# EAGLE board tc083-18 (EAGLE 6.6.0), part 1 of 6
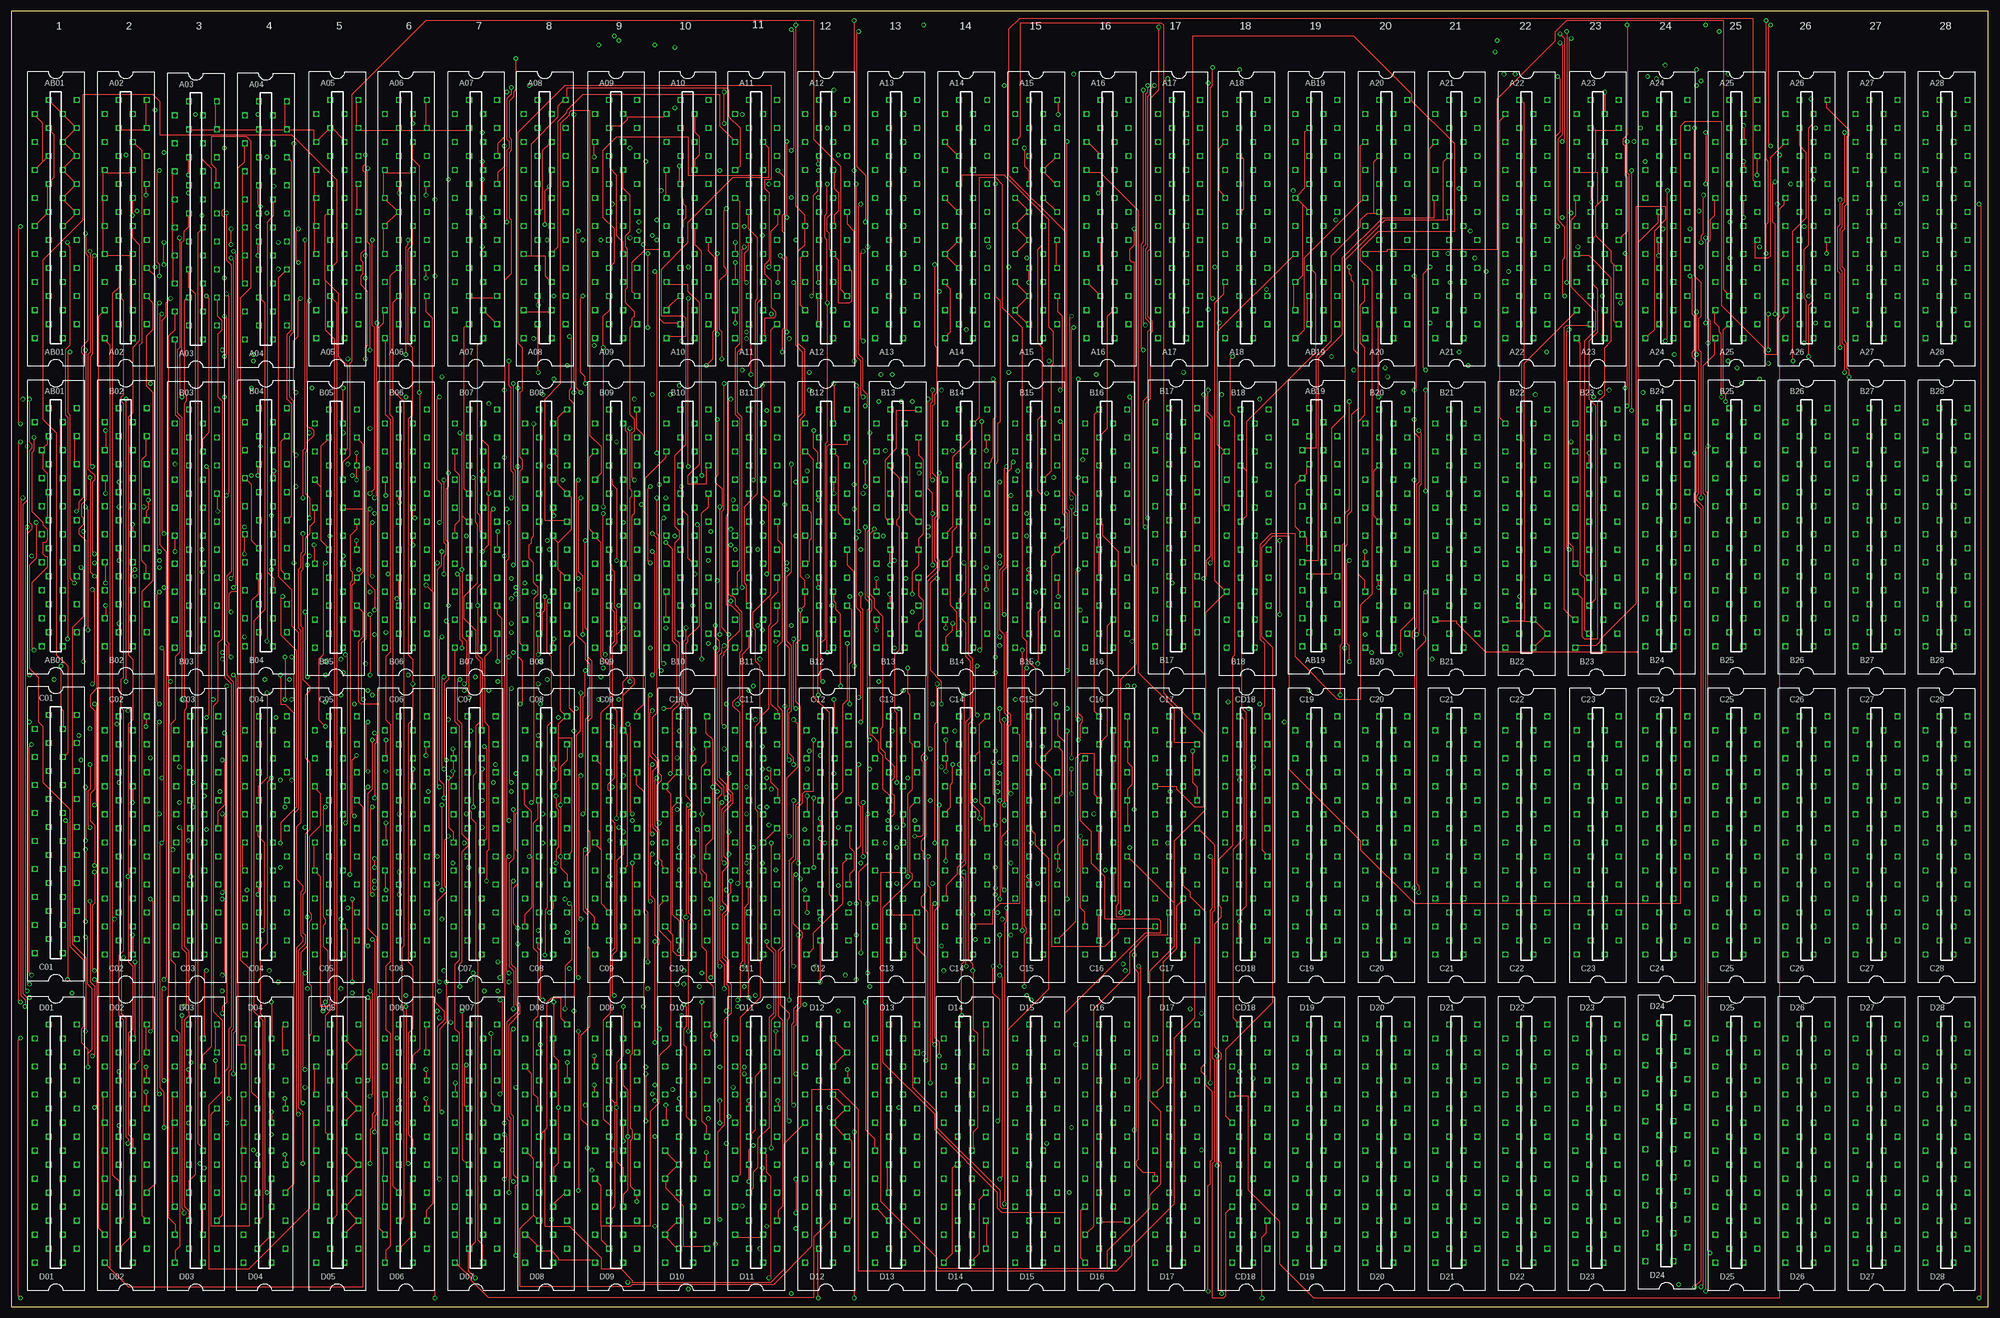
[diagram p12: board, top side]
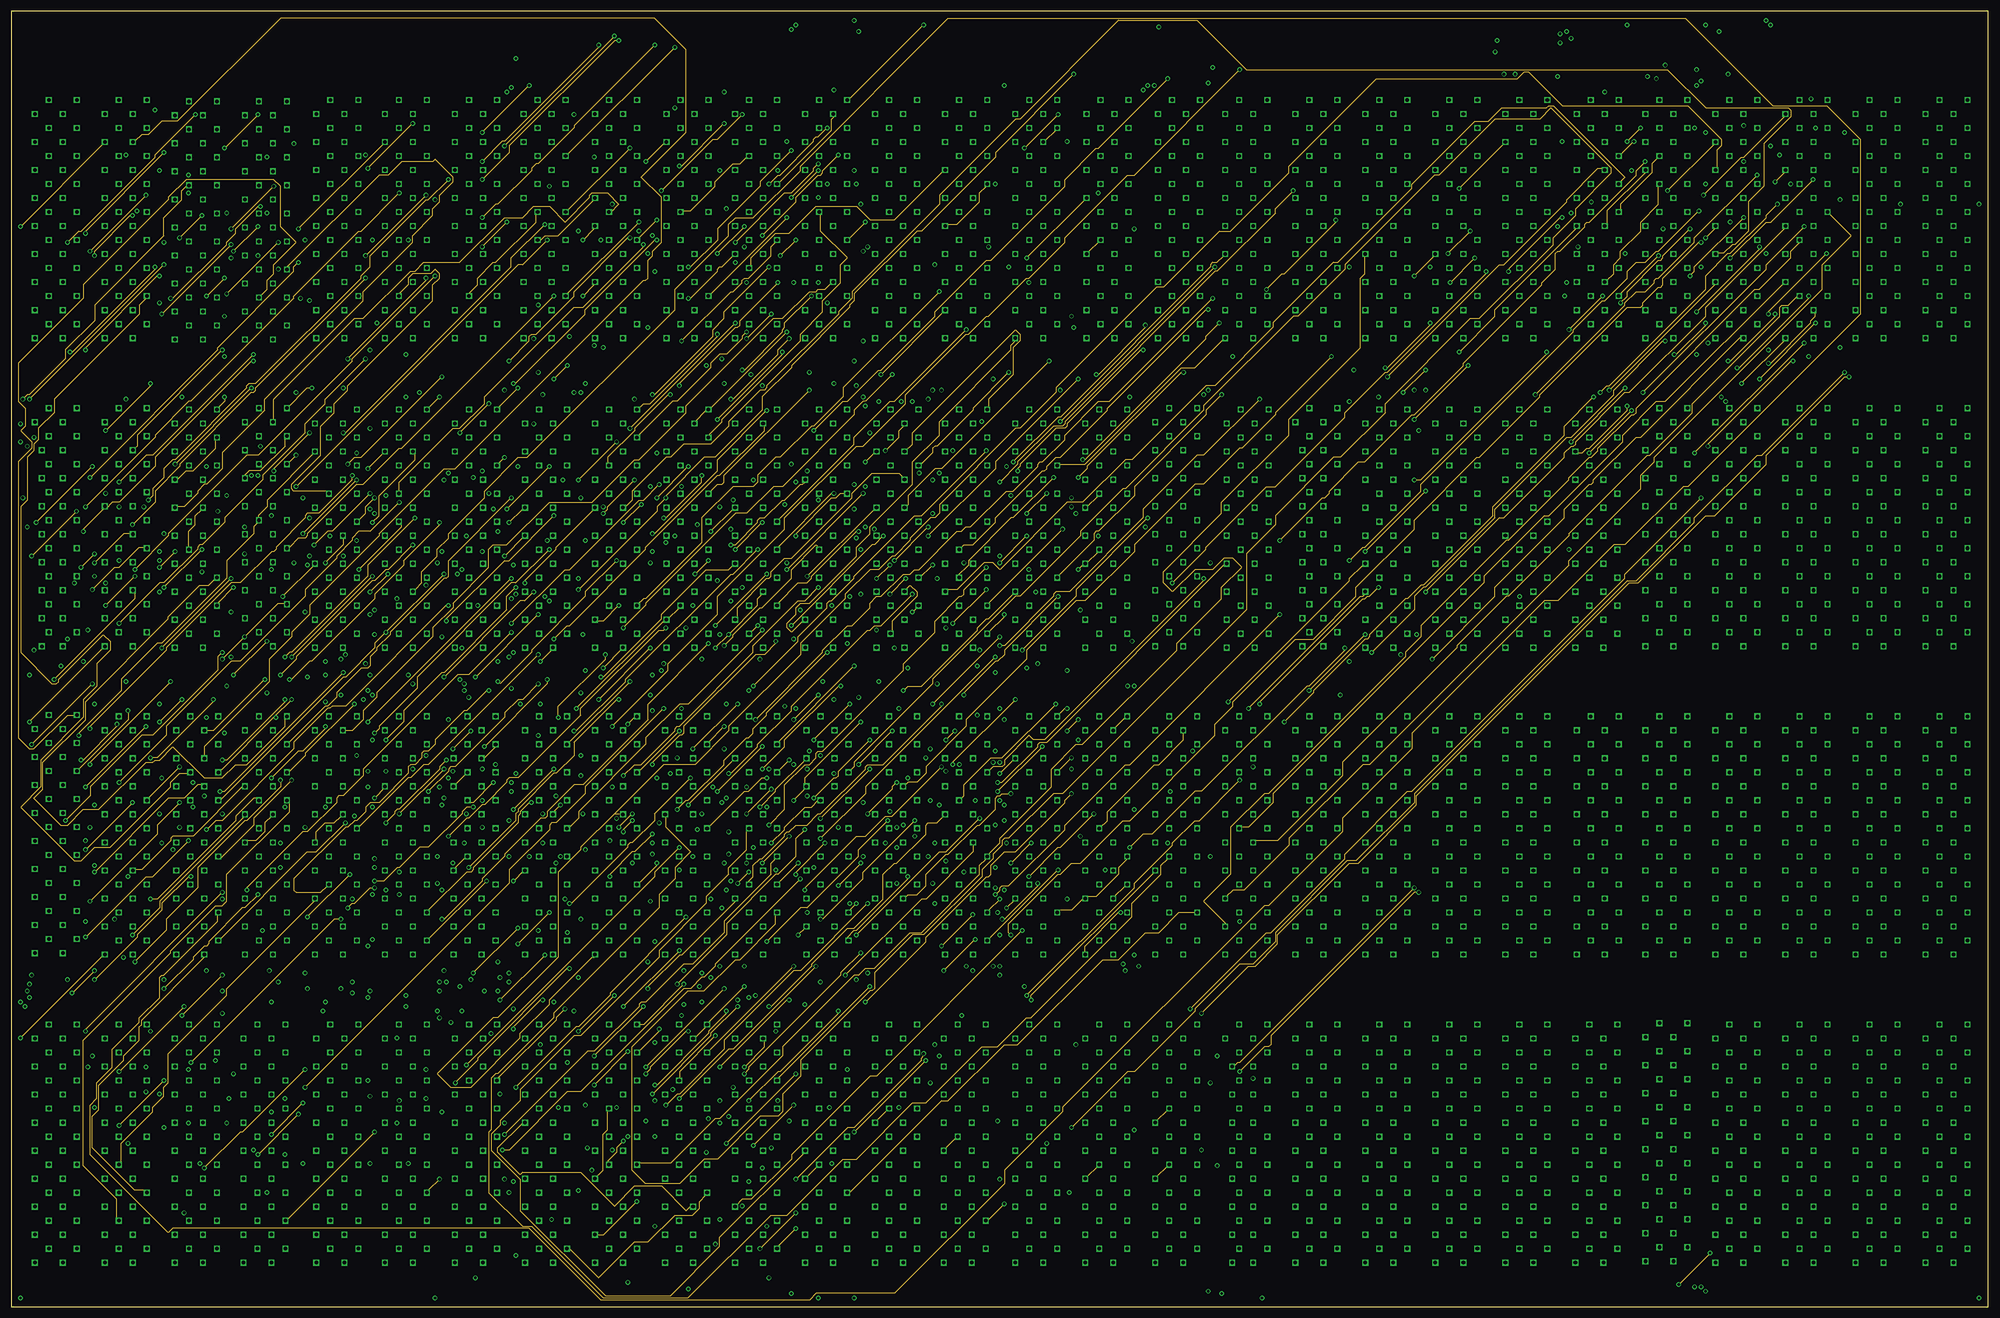
[diagram p13: board, inner layer Route2]
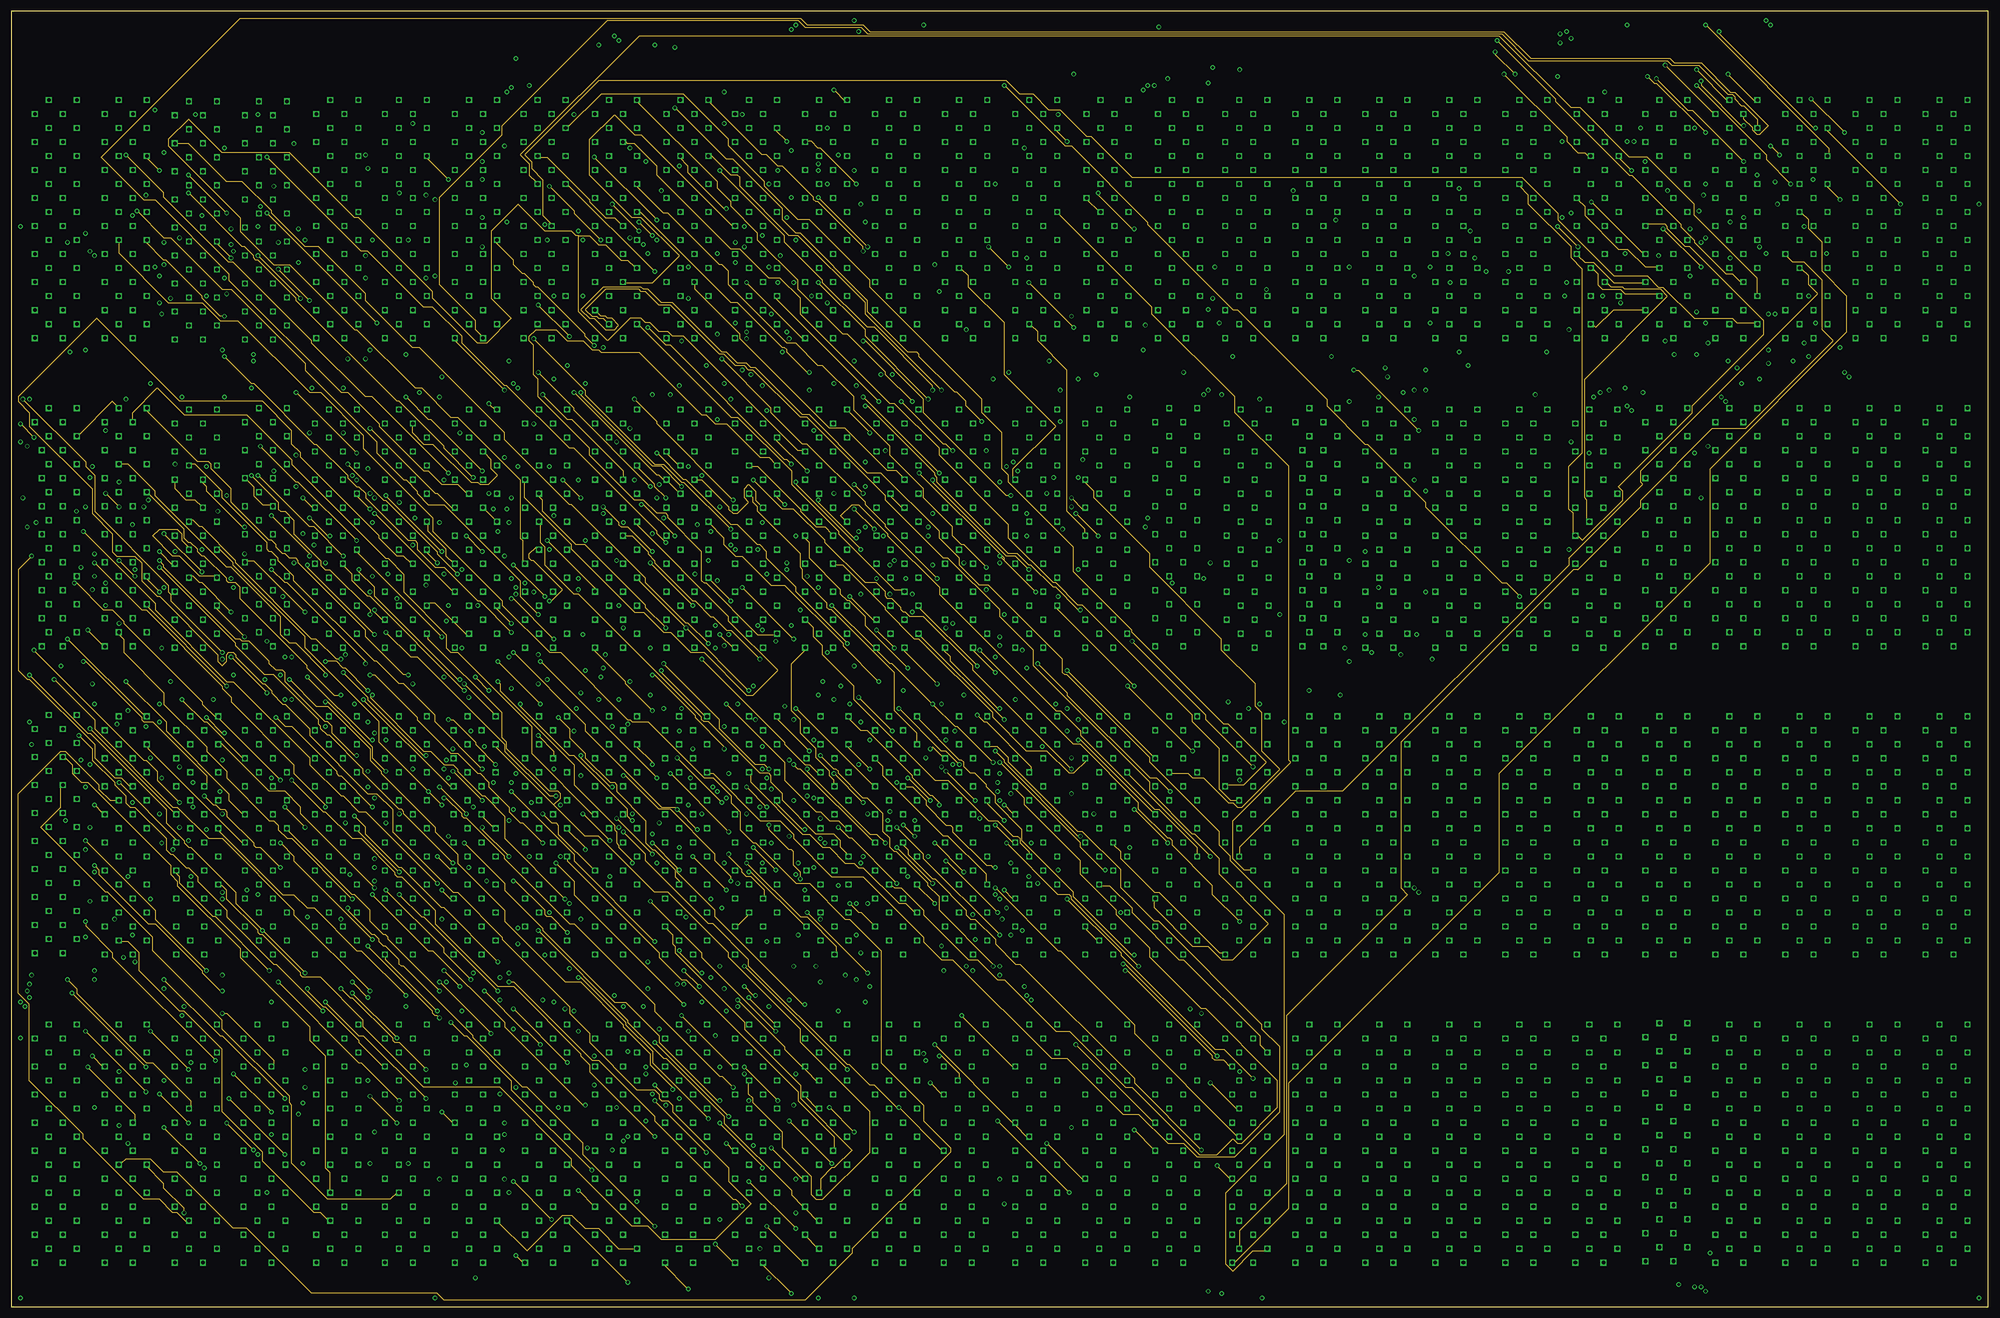
[diagram p14: board, inner layer Route15]
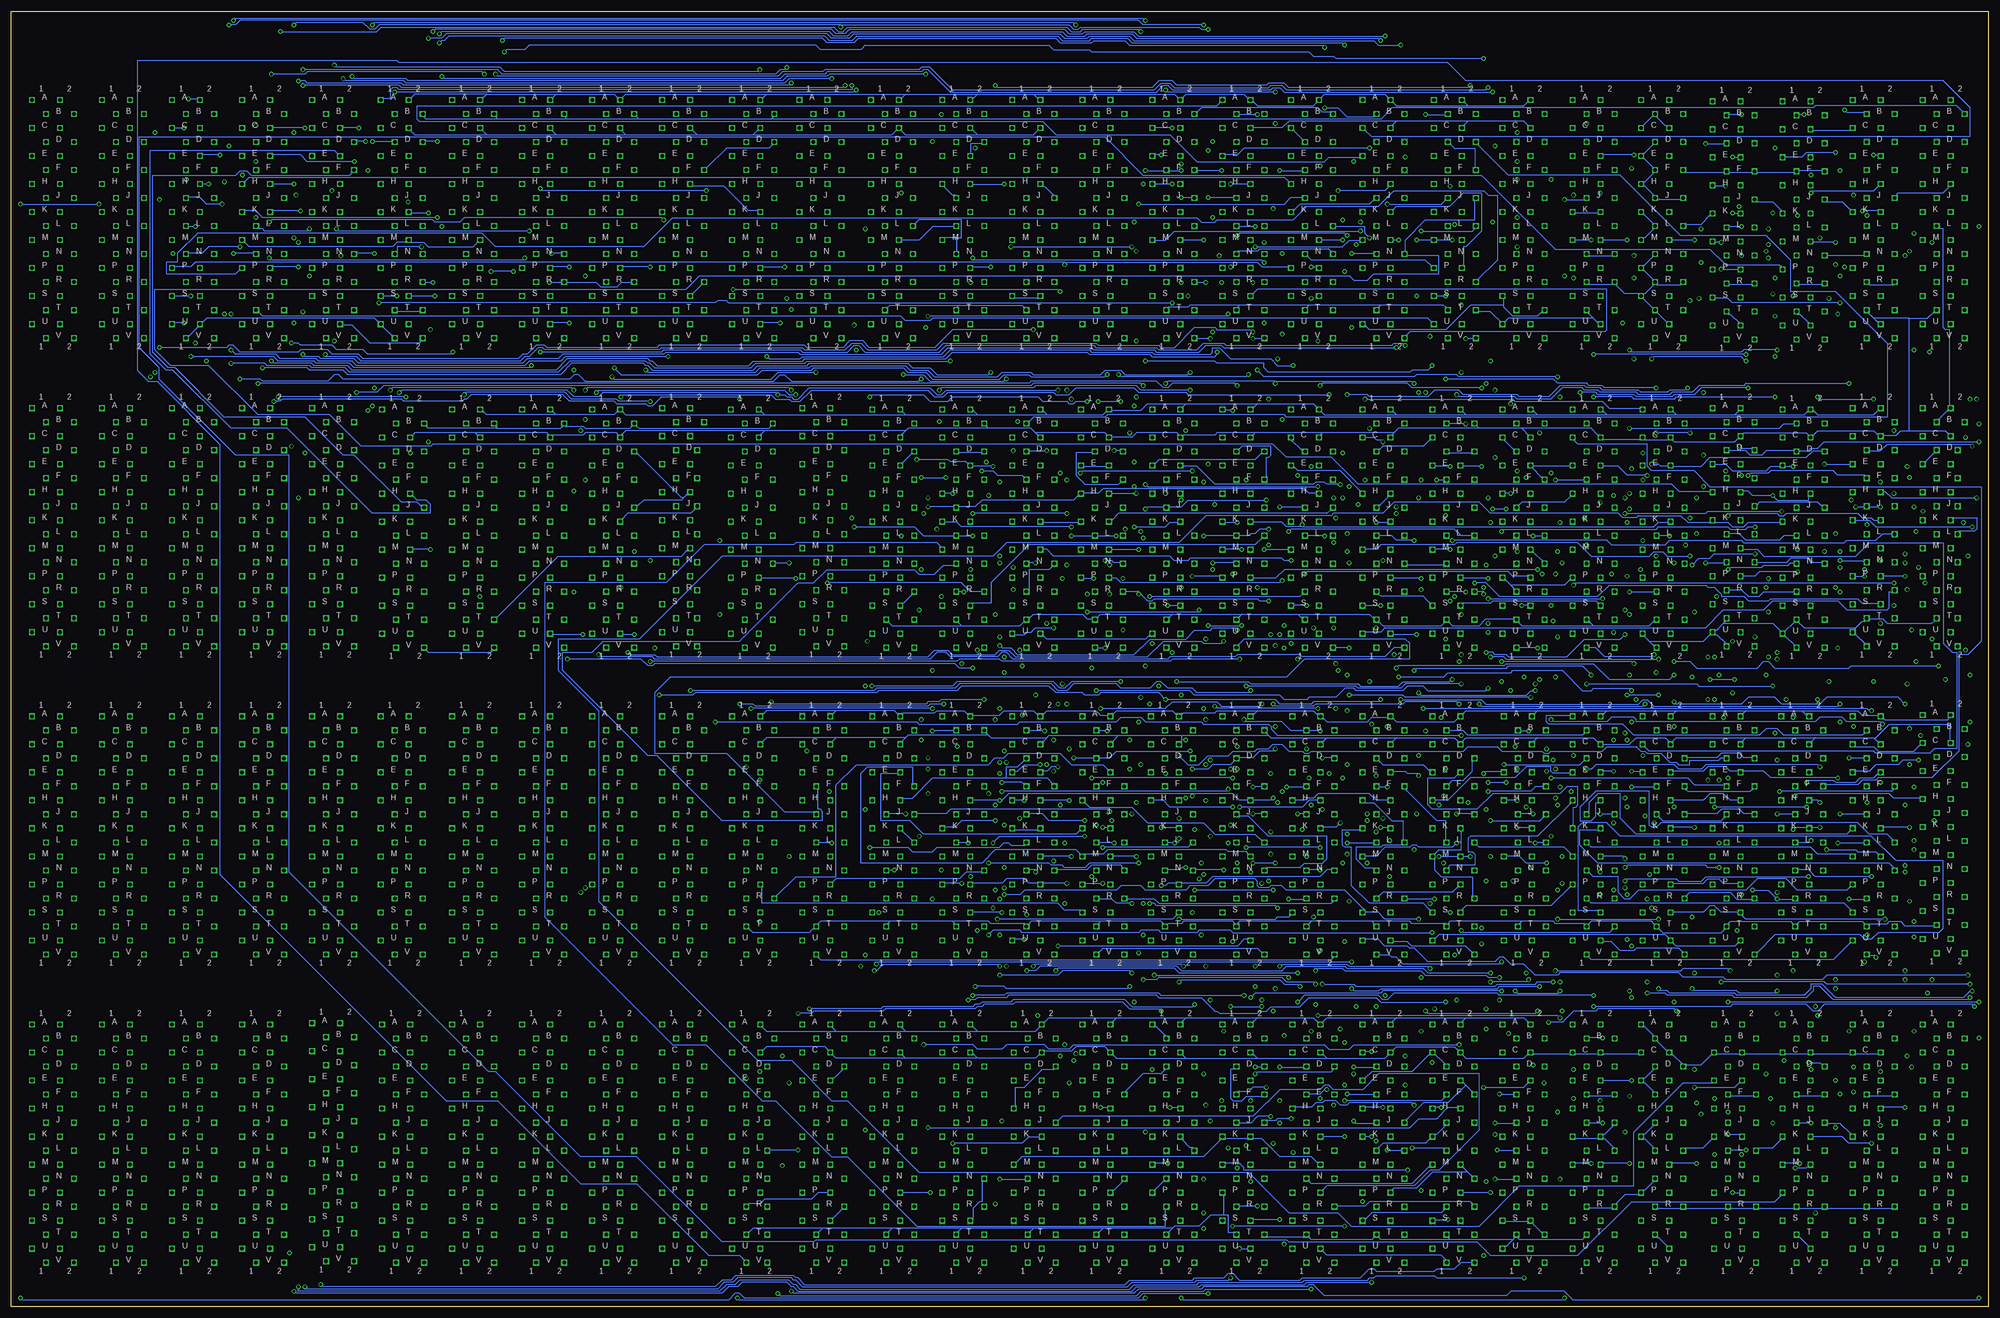
[diagram p15: board, bottom side, seen from below]

Size 448.29 x 293.68 mm. Coordinates in mm from the lower left corner, seen from the top.
Outline: 0,0 448.29,0 448.29,293.68 0,293.68 0,0
Copper layers (1*16): Top 0.035mm / dielectric 1.5mm / Bottom 0.035mm
Design rules "10mils": minimum track width 10mil, minimum drill 24mil, track to track 10mil, track to pad 10mil, pad to pad 10mil, via to via 10mil, smd to smd 10mil, copper to edge 40mil, drill to drill 10mil, minimum pad ring 10mil, minimum via ring 8mil, stop-mask expansion 0mil, vias tented up to drill 0mil, thermal gap 10mil

## Footprints (pad centres in the part's own frame; a part is rotated, then mirrored left to right if it is on the bottom)
H807 = drill 0.813 square: A1 4.763,28.575; A2 -1.587,28.575; B1 1.587,25.4; B2 -4.763,25.4; C1 4.763,22.225; C2 -1.587,22.225; D1 1.587,19.05; D2 -4.763,19.05; E1 4.763,15.875; E2 -1.587,15.875; F1 1.587,12.7; F2 -4.763,12.7; H1 4.763,9.525; H2 -1.587,9.525; J1 1.587,6.35; J2 -4.763,6.35; K1 4.763,3.175; K2 -1.587,3.175; L1 1.587,0; L2 -4.763,0; M1 4.763,-3.175; M2 -1.587,-3.175; N1 1.587,-6.35; N2 -4.763,-6.35; P1 4.763,-9.525; P2 -1.587,-9.525; R1 1.587,-12.7; R2 -4.763,-12.7; S1 4.763,-15.875; S2 -1.587,-15.875; T1 1.587,-19.05; T2 -4.763,-19.05; U1 4.763,-22.225; U2 -1.587,-22.225; V1 1.587,-25.4; V2 -4.763,-25.4
H807-2 = drill 0.813 square: AA1 4.763,60.325; AA2 -1.587,60.325; AB1 1.587,57.15; AB2 -4.763,57.15; AC1 4.763,53.975; AC2 -1.587,53.975; AD1 1.587,50.8; AD2 -4.763,50.8; AE1 4.763,47.625; AE2 -1.587,47.625; AF1 1.587,44.45; AF2 -4.763,44.45; AH1 4.763,41.275; AH2 -1.587,41.275; AJ1 1.587,38.1; AJ2 -4.763,38.1; AK1 4.763,34.925; AK2 -1.587,34.925; AL1 1.587,31.75; AL2 -4.763,31.75; AM1 4.763,28.575; AM2 -1.587,28.575; AN1 1.587,25.4; AN2 -4.763,25.4; AP1 4.763,22.225; AP2 -1.587,22.225; AR1 1.587,19.05; AR2 -4.763,19.05; AS1 4.763,15.875; AS2 -1.587,15.875; AT1 1.587,12.7; AT2 -4.763,12.7; AU1 4.763,9.525; AU2 -1.587,9.525; AV1 1.587,6.35; AV2 -4.763,6.35; BA1 4.763,-9.525; BA2 -1.587,-9.525; BB1 1.587,-12.7; BB2 -4.763,-12.7; BC1 4.763,-15.875; BC2 -1.587,-15.875; BD1 1.587,-19.05; BD2 -3.175,-19.05; BE1 4.763,-22.225; BE2 -1.587,-22.225; BF1 1.587,-25.4; BF2 -3.175,-25.4; BH1 4.763,-28.575; BH2 -1.587,-28.575; BJ1 1.587,-31.75; BJ2 -3.175,-31.75; BK1 4.763,-34.925; BK2 -1.587,-34.925; BL1 1.587,-38.1; BL2 -3.175,-38.1; BM1 4.763,-41.275; BM2 -1.587,-41.275; BN1 1.587,-44.45; BN2 -3.175,-44.45; BP1 4.763,-47.625; BP2 -1.587,-47.625; BR1 1.587,-50.8; BR2 -3.175,-50.8; BS1 4.763,-53.975; BS2 -1.587,-53.975; BT1 1.587,-57.15; BT2 -3.175,-57.15; BU1 4.763,-60.325; BU2 -1.587,-60.325; BV1 1.587,-63.5; BV2 -3.175,-63.5

## Placement (x,y rotation side)
A02  M903  [H807]  26.03,244.94 0 top
A03  M903  [H807]  41.91,244.63 0 top
A04  M903  [H807]  57.78,244.63 0 top
A05  M903  [H807]  73.97,244.94 0 top
A06  M903  [H807]  89.53,244.94 0 top
A07  A07  [H807]  105.41,244.94 0 top
A08  M206X  [H807]  120.96,244.94 0 top
A09  [H807]  137.16,244.94 0 top
A10  [H807]  153.35,244.94 0 top
A11  A11  [H807]  168.91,244.94 0 top
A12  A12  [H807]  184.78,244.94 0 top
A13  H807  [H807]  200.66,244.94 0 top
A14  [H807]  216.53,244.94 0 top
A15  [H807]  232.41,244.94 0 top
A16  [H807]  248.6,244.94 0 top
A17  H807  [H807]  264.79,244.94 0 top
A18  [H807]  280.03,244.94 0 top
A20  [H807]  311.78,244.94 0 top
A21  [H807]  327.65,244.94 0 top
A22  [H807]  343.53,244.94 0 top
A23  [H807]  359.72,244.94 0 top
A24  W023  [H807]  375.28,244.94 0 top
A25  M916  [H807]  391.15,244.94 0 top
A26  M916  [H807]  407.03,244.94 0 top
A27  H807  [H807]  422.9,244.94 0 top
A28  H807  [H807]  438.78,244.94 0 top
AB01  [H807-2]  10.16,213.19 0 top
AB19  [H807-2]  295.9,213.19 0 top
B02  [H807]  26.03,175.09 0 top
B03  [H807]  41.91,174.78 0 top
B04  [H807]  57.78,175.09 0 top
B05  [H807]  73.66,174.78 0 top
B06  B06  [H807]  89.53,174.78 0 top
B07  B07  [H807]  105.41,174.78 0 top
B08  B08  [H807]  121.28,174.78 0 top
B09  M206X  [H807]  137.16,174.78 0 top
B10  B10  [H807]  153.35,174.78 0 top
B11  [H807]  168.91,174.78 0 top
B12  [H807]  184.78,174.78 0 top
B13  M206X  [H807]  200.97,174.78 0 top
B14  M206X  [H807]  216.53,174.78 0 top
B15  [H807]  232.41,174.78 0 top
B16  [H807]  248.28,174.78 0 top
B17  H807  [H807]  264.15,175.09 0 top
B18  [H807]  280.35,174.78 0 top
B20  [H807]  311.78,174.78 0 top
B21  [H807]  327.65,174.78 0 top
B22  [H807]  343.53,174.78 0 top
B23  [H807]  359.4,174.78 0 top
B24  H807  [H807]  375.28,175.09 0 top
B25  H807  [H807]  391.15,175.09 0 top
B26  H807  [H807]  407.03,175.09 0 top
B27  H807  [H807]  422.9,175.09 0 top
B28  H807  [H807]  438.78,175.09 0 top
C01  C01  [H807]  10.16,105.56 0 top
C02  [H807]  26.03,105.25 0 top
C03  [H807]  42.22,105.25 0 top
C04  C04  [H807]  57.78,105.25 0 top
C05  C05  [H807]  73.66,105.25 0 top
C06  C06  [H807]  89.53,105.25 0 top
C07  B07  [H807]  105.09,105.25 0 top
C08  C08  [H807]  121.28,105.25 0 top
C09  M206X  [H807]  137.16,105.25 0 top
C10  [H807]  153.03,105.25 0 top
C11  [H807]  168.91,105.25 0 top
C12  [H807]  185.1,105.25 0 top
C13  [H807]  200.66,105.25 0 top
C14  M206X  [H807]  216.53,105.25 0 top
C15  [H807]  232.41,105.25 0 top
C16  C16  [H807]  248.28,105.25 0 top
C17  C17  [H807]  264.15,105.25 0 top
C19  H807  [H807]  295.9,105.25 0 top
C20  H807  [H807]  311.78,105.25 0 top
C21  H807  [H807]  327.65,105.25 0 top
C22  H807  [H807]  343.53,105.25 0 top
C23  H807  [H807]  359.72,105.25 0 top
C24  H807  [H807]  375.28,105.25 0 top
C25  H807  [H807]  391.15,105.25 0 top
C26  H807  [H807]  407.03,105.25 0 top
C27  H807  [H807]  422.9,105.25 0 top
C28  H807  [H807]  438.78,105.25 0 top
CD18  [H807-2]  280.03,73.5 0 top
D01  H807  [H807]  10.16,35.39 0 top
D02  M903  [H807]  26.03,35.39 0 top
D03  M903  [H807]  41.91,35.39 0 top
D04  M903  [H807]  57.46,35.39 0 top
D05  M903  [H807]  73.97,35.39 0 top
D06  M903  [H807]  89.53,35.39 0 top
D07  D07  [H807]  105.41,35.39 0 top
D08  [H807]  121.28,35.39 0 top
D09  [H807]  137.16,35.39 0 top
D10  [H807]  153.03,35.39 0 top
D11  M206X  [H807]  168.91,35.39 0 top
D12  D12  [H807]  184.78,35.39 0 top
D13  D13  [H807]  200.66,35.39 0 top
D14  [H807]  216.21,35.39 0 top
D15  [H807]  232.41,35.39 0 top
D16  [H807]  248.28,35.39 0 top
D17  D17  [H807]  264.15,35.39 0 top
D19  H807  [H807]  295.9,35.39 0 top
D20  H807  [H807]  311.78,35.39 0 top
D21  H807  [H807]  327.65,35.39 0 top
D22  H807  [H807]  343.53,35.39 0 top
D23  H807  [H807]  359.4,35.39 0 top
D24  H807  [H807]  375.28,35.71 0 top
D25  H807  [H807]  391.15,35.39 0 top
D26  H807  [H807]  407.03,35.39 0 top
D27  H807  [H807]  422.9,35.39 0 top
D28  H807  [H807]  438.78,35.39 0 top

## Tracks (layer width: path | path; a pad name or v marks a point on that pad's centre or on a via)
0_TO_DTB  (via drill 0.61)
  Top 0.254: v162.68,102.58 v162.68,107.66 | v149.47,120.87 149.98,121.37 149.98,135.09 151.51,136.61 151.51,150.33 150.49,151.35 150.49,173.19 151.51,174.21 151.51,175.73 150.49,176.75 150.49,193 153.03,195.54 153.03,217.89 v152.01,218.91
  Route2 0.254: v152.01,218.91 163.19,230.09 163.7,230.09 165.73,232.12 165.73,232.63 166.24,233.13 167.25,233.13 172.33,238.21 172.33,240.25 173.35,241.26 A11.M1
  Route15 0.254: v162.68,102.58 162.68,102.07 165.73,99.02 165.73,98.51 166.75,97.5 167.76,97.5 170.81,94.45 170.81,92.93 C11.R1 | v162.68,107.66 v149.47,120.87
0_TO_EF
  Route2 0.254: A10.K2 152.01,248.37 154.05,248.37 159.63,253.96 159.63,254.98 163.7,259.04 165.22,259.04 166.75,260.57 A11.E2
0_TO_STA
  Bottom 0.254: A10.N2 148.97,239.23 149.47,239.74 165.22,239.74 165.73,239.23 170.3,239.23 A11.N1
1_TO_DF  (via drill 0.61)
  Top 0.254: C12.L1 186.56,105.63 186.56,111.21 C12.J1 186.56,112.23 186.56,114.77 188.59,116.8 188.59,136.61 189.61,137.63 v189.61,150.33 | v145.92,234.66 146.43,234.15 v146.43,193.51 | v177.92,52.79 177.41,53.3 177.41,63.46 177.92,63.97 177.92,67.02 178.94,68.03 178.94,83.27 179.45,83.78 179.45,84.8 177.41,86.83 177.41,97.5 v177.92,98.01
  Route2 0.254: v177.92,52.79 v162.17,37.05 | v177.92,98.01 177.92,98.51 v184.53,105.12
  Route15 0.254: v145.92,234.66 126.11,254.47 A08.H1 | v146.43,193.51 152.52,187.41 153.03,187.41 163.19,177.25 164.71,177.25 169.29,172.68 169.79,172.68 171.32,171.16 171.32,169.63 177.92,163.03 177.92,162.01 v189.61,150.33 | v162.17,37.05 163.7,35.52 D11.L2
  Bottom 0.254: v184.53,105.12 186.05,105.12 C12.L1
1_TO_DTF  (via drill 0.61)
  Top 0.254: v160.65,19.77 160.14,20.28 160.14,39.59 161.67,41.11 161.67,64.99 163.19,66.51 163.19,73.11 162.68,73.62 162.68,78.7 161.67,79.72 161.67,88.35 162.68,89.37 162.68,93.43 163.19,93.94 v163.19,96.48 | v183,163.03 183,165.06 B12.P2
  Route2 0.254: v138.81,120.36 141.35,122.9 142.87,122.9 150.49,130.52 150.49,131.03 151,131.53 151.51,131.53 168.27,148.3 168.27,149.82 178.43,159.98 179.95,159.98 v183,163.03
  Route15 0.254: v163.19,96.48 163.19,97.5 159.63,101.05 159.63,102.58 149.47,112.74 146.93,112.74 139.31,120.36 v138.81,120.36
  Bottom 0.254: v160.65,19.77 166.75,19.77 D11.S2
76
  Bottom 0.254: C04.V2 52.45,80.23 48.38,84.29 29.08,84.29 28.06,83.27 26.54,83.27 25.01,84.8 11.3,84.8 10.28,85.81 10.28,101.05 20.95,101.05 26.54,106.64 83.43,106.64 86.48,109.69 92.07,109.69 93.09,108.67 93.09,89.88 88.51,89.88 C06.S2
76+77  (via drill 0.61)
  Route2 0.254: v82.42,94.96 81.4,94.96 77.85,91.4 77.34,91.4 v76.32,90.39
  Route15 0.254: v82.42,94.96 65.65,111.72 65.65,113.25 62.1,116.8 58.54,116.8 47.37,127.98 C03.C1 | v76.32,90.39 76.32,89.88 81.91,84.29 82.42,84.29 83.43,83.27 83.43,82.77 84.45,81.75 84.96,81.75 88.01,78.7 88.01,77.69 88.51,77.18 89.02,77.18 104.77,61.43 104.77,60.92 115.95,49.75 116.96,49.75 129.66,37.05 129.66,34.51 v145.92,18.25 | v171.32,18.25 179.45,10.12 D12.V2
  Bottom 0.254: v145.92,18.25 v171.32,18.25
77
  Bottom 0.254: C05.V2 69.21,80.23 70.23,81.24 79.88,81.24 80.39,80.73 83.43,80.73 85.47,82.77 87.5,82.77 C06.U2
!00  (via drill 0.61)
  Top 0.254: v106.8,266.15 106.8,264.63 A07.D1 | v342.01,161 342.01,159.47 B22.S2
  Route2 0.254: v106.8,266.15 v117.47,276.82
  Route15 0.254: v225.17,276.82 238.88,263.11 240.41,263.11 257.68,245.83 257.68,245.33 276.98,226.02 278,226.02 298.32,205.7 298.32,204.18 306.95,195.54 307.46,195.54 320.67,182.33 320.67,181.32 337.94,164.05 338.96,164.05 v342.01,161
  Bottom 0.254: v117.47,276.82 117.98,276.31 158.62,276.31 159.63,277.33 163.19,277.33 163.7,276.82 184.02,276.82 185.03,277.84 188.08,277.84 189.61,276.31 224.66,276.31 v225.17,276.82
!0_TO_AC  (via drill 0.61)
  Top 0.254: v81.4,180.81 80.89,180.3 80.89,164.05 82.42,162.52 v82.42,157.95
  Route15 0.254: v81.4,180.81 78.35,183.86 B05.H1 | v82.42,157.95 82.42,157.44 84.45,155.41 B06.T2
!0_TO_DTB  (via drill 0.61)
  Top 0.254: 143.38,181.83 143.38,136.61 141.85,135.09 141.85,134.07 C09.A1 | 143.38,181.83 143.38,197.57 141.85,199.1 141.85,203.16 B09.A1 | v140.84,111.72 140.33,112.23 140.33,131.53 v139.82,132.04 | 143.38,181.83 v142.87,181.83 | v160.14,220.43 v160.14,238.72
  Route2 0.254: v140.84,111.72 v137.79,108.67 | v139.82,132.04 141.35,133.57 C09.A1 | v142.87,181.83 v138.81,177.76 | v160.14,238.72 v166.24,244.82 | v160.14,220.43 160.14,219.93 144.9,204.69 143.38,204.69 142.36,203.67 B09.A1
  Route15 0.254: v150.49,174.71 143.38,181.83 v142.87,181.83
  Bottom 0.254: v137.79,108.67 135.76,108.67 C09.K2 | v138.81,177.76 135.76,177.76 B09.K2 | v150.49,174.71 154.55,174.71 B10.L1 | v166.24,244.82 170.3,244.82 A11.L1
!0_TO_EF
  Top 0.254: 117.98,238.21 121.03,238.21 121.03,233.64 122.04,232.63 A08.R1 | 117.98,238.21 116.45,238.21 A08.N2 | 117.98,238.21 117.98,263.61 124.07,269.71 124.07,272.25 125.09,273.27 A08.A1 126.11,273.77 126.11,276.31 162.17,276.31 162.68,275.81 162.68,269.71 165.22,267.17 165.22,258.53 164.71,258.03 A11.F2
!0_TO_LPB
  Top 0.254: 121.03,40.09 121.53,40.6 121.53,69.05 122.55,70.07 124.58,70.07 124.58,65.49 125.6,64.48 D08.A1 | 121.03,40.09 120.01,39.08 D08.K2 | 121.03,40.09 121.03,18.25 126.61,18.25 133.73,11.14 133.73,8.6 138.3,8.6 140.84,6.06 140.84,5.55 172.33,5.55 175.38,8.6 175.38,37.05 179.45,41.11 D12.J2
!0_TO_STA  (via drill 0.61)
  Top 0.254: 102.23,179.29 103.25,178.27 B07.K2 | 102.23,179.29 102.23,197.57 v101.72,198.08 | v102.74,141.19 103.25,141.69 103.25,150.84 102.23,151.85 v102.23,167.09 102.23,179.29 | v173.86,232.12 173.86,235.17 A11.P1
  Route2 0.254: v101.72,198.08 v108.33,204.69 | v173.86,232.12 165.22,223.48 165.22,222.47 164.71,221.96 164.21,221.96 151.51,209.26 v151.51,208.75 | v114.93,208.24 110.36,203.67 B07.A1
  Route15 0.254: v108.33,204.69 109.85,203.16 B07.A1 | v102.74,141.19 109.85,134.07 C07.A1
  Bottom 0.254: v102.23,167.09 159.63,167.09 161.67,165.06 166.75,165.06 B11.P2 | v151.51,208.75 151,209.26 131.69,209.26 130.68,208.24 v114.93,208.24
!0_TO_STATE
  Route15 0.254: CD18.AV2 274.95,80.23 273.93,80.23 260.22,93.94 259.2,93.94 251.58,101.56 251.58,103.09 250.06,104.61 C16.L1
!0_TO_W  (via drill 0.61)
  Top 0.254: v271.9,50.76 271.9,89.88 272.41,90.39 272.41,101.56 v271.9,102.07
  Route15 0.254: v271.9,50.76 278,44.67 CD18.BH2 | v271.9,102.07 253.11,120.87 C16.E1
!01  (via drill 0.61)
  Top 0.254: v350.64,244.82 350.64,245.33 350.13,245.83 350.13,265.14 351.15,266.15 351.15,278.35 v350.64,278.85 | v112.39,275.3 111.88,274.79 111.88,265.14 110.36,263.61 110.36,261.07 A07.E1
  Route15 0.254: v350.64,244.82 v355.21,240.25
  Bottom 0.254: v355.21,240.25 360.8,240.25 360.8,239.23 A23.N1 | v350.64,278.85 350.13,278.35 273.93,278.35 272.92,279.36 263.77,279.36 263.27,279.87 241.93,279.87 241.42,280.38 240.41,280.38 235.33,275.3 188.59,275.3 187.07,276.82 186.05,276.82 185.03,275.81 162.68,275.81 162.17,276.31 160.65,276.31 159.63,275.3 v112.39,275.3
!02  (via drill 0.61)
  Top 0.254: v106.8,255.49 106.8,251.93 A07.J1 | v351.15,288.51 352.17,287.49 352.17,264.63 v351.66,264.12
  Route2 0.254: v106.8,255.49 112.9,261.58 112.9,263.11 136.77,286.98 v137.79,286.98
  Bottom 0.254: v137.79,286.98 138.3,287.49 193.16,287.49 194.18,288.51 204.34,288.51 204.85,288 208.91,288 209.93,289.01 257.68,289.01 258.69,288 261.74,288 262.76,289.01 350.64,289.01 v351.15,288.51 | v351.66,264.12 354.71,264.12 A23.D2
!03  (via drill 0.61)
  Top 0.254: v106.8,240.25 106.8,239.23 A07.N1 | v112.39,245.83 112.39,262.09 112.9,262.6 112.9,264.12 112.39,264.63 112.39,273.77 113.41,274.79 v113.41,276.31
  Route2 0.254: v112.39,245.83 v106.8,240.25
  Route15 0.254: v338.45,279.36 352.67,265.14 352.67,264.12 355.21,261.58 356.74,261.58 357.75,260.57 A23.E2
  Bottom 0.254: v113.41,276.31 113.91,275.81 159.13,275.81 160.14,276.82 162.68,276.82 163.19,276.31 184.53,276.31 185.54,277.33 187.57,277.33 189.1,275.81 234.82,275.81 239.9,280.89 241.93,280.89 242.44,280.38 263.77,280.38 264.28,279.87 273.43,279.87 274.44,278.85 337.94,278.85 v338.45,279.36
!04  (via drill 0.61)
  Top 0.254: v353.69,247.87 353.18,248.37 353.18,286.98 v353.69,287.49 | v106.8,259.55 106.8,258.03 A07.F1
  Route2 0.254: v133.22,285.97 133.22,285.46 111.88,264.12 111.37,264.12 v106.8,259.55
  Bottom 0.254: v353.69,247.87 357.75,247.87 A23.K2 | v353.69,287.49 350.64,287.49 349.63,288.51 263.27,288.51 262.25,287.49 258.19,287.49 257.17,288.51 210.43,288.51 209.42,287.49 204.34,287.49 203.83,288 194.69,288 193.67,286.98 139.31,286.98 138.3,285.97 v133.22,285.97
!05  (via drill 0.61)
  Route2 0.254: v328.29,216.37 336.42,224.5 336.42,226.02 354.71,244.31 A23.L2
  Route15 0.254: v132.2,217.89 130.17,219.93 130.17,220.43 119.5,231.1 118.99,231.1 118.49,231.61 118.49,232.12 116.45,234.15 115.95,234.15 113.91,236.18 113.91,237.2 109.85,241.26 A07.M1
  Bottom 0.254: v132.2,217.89 132.71,218.4 134.74,218.4 135.25,217.89 172.84,217.89 173.35,218.4 177.92,218.4 179.45,216.88 188.08,216.88 188.59,217.39 202.31,217.39 202.81,217.89 236.34,217.89 237.87,216.37 254.63,216.37 256.15,217.89 257.17,217.89 258.69,216.37 268.85,216.37 269.36,216.88 300.35,216.88 300.86,216.37 v328.29,216.37
!06  (via drill 0.61)
  Top 0.254: v352.67,289.01 v352.67,232.12 | v111.88,263.11 111.88,258.53 110.36,257.01 110.36,254.98 A07.H1
  Route2 0.254: v136.77,288 v111.88,263.11
  Bottom 0.254: v352.67,232.12 354.71,232.12 A23.R2 | v352.67,289.01 352.17,289.52 262.25,289.52 261.23,288.51 259.2,288.51 258.19,289.52 209.42,289.52 208.4,288.51 205.35,288.51 204.85,289.01 193.67,289.01 192.65,288 v136.77,288
!07  (via drill 0.61)
  Top 0.254: v352.17,229.07 351.66,229.58 351.66,237.2 352.17,237.71 352.17,244.82 350.64,246.34 350.64,264.63 351.66,265.65 351.66,285.97 v351.15,286.47 | v106.8,246.85 106.8,245.33 A07.L1
  Route2 0.254: v145.92,285.97 127.63,267.68 127.63,267.17 119.5,259.04 118.99,259.04 117.98,258.03 117.98,257.52 110.36,249.9 109.85,249.9 v106.8,246.85
  Bottom 0.254: v352.17,229.07 357.75,229.07 A23.S2 | v351.15,286.47 350.64,286.98 350.13,286.98 349.12,288 263.77,288 262.76,286.98 257.68,286.98 256.66,288 210.94,288 209.93,286.98 203.83,286.98 203.32,287.49 195.19,287.49 194.18,286.47 146.43,286.47 v145.92,285.97
!76  (via drill 0.61)
  Route15 0.254: v119.5,85.31 139.82,64.99 139.82,64.48 147.95,56.35 148.46,56.35 161.67,43.14 161.67,41.62 176.91,26.38 176.91,25.36 179.45,22.82 D12.R2 179.95,22.31 183,19.27 D12.S2
  Bottom 0.254: v119.5,85.31 118.99,84.8 85.97,84.8 84.96,85.81 C06.T2
!77  (via drill 0.61)
  Top 0.254: v96.64,67.02 96.13,66.51 v96.13,1.99 | v183,1.99 183,12.66 D12.U2
  Route15 0.254: v96.64,67.02 84.96,78.7 84.96,79.21 C06.V2 | D12.T2 179.95,16.22 183,13.17 D12.U2
  Bottom 0.254: v96.13,1.99 96.64,1.49 182.49,1.49 v183,1.99
!-ADDR_ACC  (via drill 0.61)
  Top 0.254: v2.15,60.92 1.65,60.41 1.65,2.5 v2.15,1.99 | v271.39,3.52 271.39,27.39 271.9,27.9 271.9,32.98 272.41,33.49 272.41,48.73 270.89,50.25 270.89,52.29 269.87,53.3 269.87,54.32 270.89,55.33 270.89,89.37 267.33,92.93 267.33,93.94 265.81,95.47 265.81,98.51 C17.N1
  Route2 0.254: v2.15,60.92 20.95,79.72 C02.V2
  Bottom 0.254: v2.15,1.99 2.66,1.49 94.1,1.49 96.13,3.52 108.33,3.52 109.34,2.5 150.49,2.5 153.03,5.04 154.05,5.04 154.55,4.53 177.92,4.53 178.43,4.03 192.65,4.03 193.67,3.01 270.89,3.01 v271.39,3.52
!-XSTA
  Top 0.254: D13.M2 198.75,31.97 198.75,26.38 D13.P2
  Bottom 0.254: D13.N2 196.21,28.41 198.24,26.38 198.75,26.38 D13.P2
!B-BRK  (via drill 0.61)
  Top 0.254: v21.46,184.37 21.46,187.41 B02.F2 | 29.59,181.32 29.59,169.13 30.6,168.11 30.6,166.08 B02.P1 | 29.59,181.32 29.59,191.99 30.6,193 30.6,197.07 B02.C1 | v33.65,136.61 33.14,137.12 33.14,161.51 v33.65,162.01 | v21.46,158.97 21.46,156.43 B02.T2 | v24.51,169.13 24.51,171.67 B02.M2 | 29.59,181.32 v30.09,181.32
  Route2 0.254: v133.22,137.63 v144.9,149.31 | v28.06,165.57 v21.46,158.97
  Route15 0.254: v24.51,181.32 v21.46,184.37 | v33.65,162.01 30.6,165.06 B02.P1 | v28.06,165.57 v24.51,169.13
  Bottom 0.254: v24.51,181.32 27.05,181.32 B02.J1 28.06,181.32 v30.09,181.32 | v144.9,149.31 147.95,149.31 B10.V2 | v133.22,137.63 114.93,137.63 113.91,136.61 79.37,136.61 78.35,137.63 77.34,137.63 75.81,136.11 34.16,136.11 v33.65,136.61 | v28.06,165.57 30.6,165.57 B02.P1
!BAC_00  (via drill 0.61)
  Top 0.254: v97.15,177.76 97.66,178.27 97.66,186.4 96.64,187.41 96.64,205.7 v97.15,206.21
  Route2 0.254: v57.53,142.2 45.84,130.52 44.32,130.52 C03.B1 | v63.11,142.2 63.62,142.2 67.69,146.27 68.19,146.27 82.42,160.49 82.42,161.51 89.02,168.11 89.02,169.13 97.15,177.25 v97.15,177.76 | v97.15,206.21 94.61,203.67 B06.A1
  Route15 0.254: v149.98,49.24 149.98,49.75 144.9,54.83 144.9,57.37 138.81,63.46 138.81,63.97 129.15,73.62 125.6,73.62 111.88,87.34 111.88,89.88 101.21,100.55 101.21,102.58 96.13,107.66 96.13,108.67 83.94,120.87 83.94,121.37 81.4,123.91 81.4,126.45 71.75,136.11 69.21,136.11 v63.11,142.2
  Bottom 0.254: v63.11,142.2 v57.53,142.2 | v149.98,49.24 150.49,49.24 151.51,48.22 154.05,48.22 D10.F1
!BAC_01  (via drill 0.61)
  Top 0.254: v63.62,137.63 64.13,138.14 64.13,146.77 v63.62,147.28 | v81.91,165.57 81.4,166.08 81.4,177.25 v81.91,177.76 | v81.91,93.43 81.4,93.94 81.4,112.74 v81.91,113.25
  Route2 0.254: v63.62,137.63 59.56,133.57 | 59.56,133.57 47.37,121.37 C03.E1 | v81.91,165.57 v63.62,147.28 | v81.91,177.76 83.43,179.29 83.43,183.86 91.56,191.99 91.56,193.51 B06.D1 | 59.56,133.57 v60.07,133.57
  Route15 0.254: v130.17,45.68 129.66,45.68 111.88,63.46 111.88,64.48 95.63,80.73 94.61,80.73 v81.91,93.43 | v81.91,113.25 74.8,120.36 74.29,120.36 73.78,120.87 73.78,121.37 63.62,131.53 62.1,131.53 v60.07,133.57
  Bottom 0.254: v130.17,45.68 130.68,46.19 144.9,46.19 145.41,45.68 146.93,45.68 147.95,46.7 150.49,46.7 151,46.19 152.52,46.19 153.54,45.17 157.6,45.17 D10.H1
!BAC_02  (via drill 0.61)
  Top 0.254: v98.17,166.08 98.17,170.14 98.67,170.65 98.67,172.68 98.17,173.19 v98.17,187.41 | v152.52,68.54 153.03,68.03 153.03,63.46 152.52,62.95 152.52,59.4 153.03,58.89 153.03,43.14 154.05,42.13 D10.J1 | v123.57,100.55 123.57,103.59 124.07,104.1 124.07,112.74 123.57,113.25 v123.57,115.79
  Route2 0.254: v98.17,166.08 v84.96,152.87 82.42,150.33 82.42,149.31 75.81,142.71 75.31,142.71 47.37,114.77 C03.H1
  Route15 0.254: v152.52,68.54 127.63,93.43 127.63,96.48 v123.57,100.55 | v123.57,115.79 122.04,115.79 111.88,125.95 111.88,127.47 92.07,147.28 90.55,147.28 v84.96,152.87
  Bottom 0.254: v98.17,187.41 91.56,187.41 B06.F1
!BAC_03  (via drill 0.61)
  Top 0.254: v47.87,123.91 48.38,123.41 48.38,113.75 46.86,112.23 46.86,108.67 C03.K1 | v62.1,147.28 v62.1,137.63 | v91.56,178.78 91.05,179.29 91.05,180.81 B06.J1 | v156.59,69.05 156.59,42.13 157.6,41.11 157.6,39.08 D10.K1
  Route2 0.254: v47.87,123.91 48.89,123.91 62.1,137.12 v62.1,137.63 | v62.1,147.28 63.11,148.3 63.62,148.3 80.89,165.57 80.89,168.11 v91.56,178.78
  Route15 0.254: v89.53,70.57 79.37,80.73 78.35,80.73 68.7,90.39 67.18,90.39 64.13,93.43 61.59,93.43 46.86,108.17 C03.K1
  Bottom 0.254: v156.59,69.05 155.06,70.57 138.3,70.57 137.28,69.56 136.27,69.56 134.74,71.08 111.37,71.08 110.87,70.57 v89.53,70.57
!BAC_04  (via drill 0.61)
  Top 0.254: v63.62,119.34 64.13,119.85 64.13,134.58 62.1,136.61 61.08,136.61 v61.08,143.22 | v91.05,172.68 91.05,174.21 B06.L1
  Route2 0.254: v63.62,119.34 54.99,110.71 54.99,109.18 47.37,101.56 C03.M1 | v61.08,143.22 64.64,146.77 64.64,147.28 81.91,164.55 82.42,164.55 84.96,167.09 85.47,167.09 v91.05,172.68
  Route15 0.254: v145.92,38.57 131.19,53.3 131.19,54.83 129.15,56.86 129.15,57.37 113.91,72.61 110.36,72.61 96.13,86.83 96.13,89.88 88.51,97.5 87.5,97.5 86.99,98.01 86.99,98.51 79.37,106.13 77.34,106.13 71.24,112.23 70.73,112.23 v63.62,119.34
  Bottom 0.254: v145.92,38.57 151,38.57 D10.K2
!BAC_05
  Route15 0.254: C03.P1 47.37,95.47 47.87,95.47 48.89,94.45 48.89,92.42 56,85.31 56,84.8 56.51,84.29 57.02,84.29 65.65,75.65 65.65,75.15 66.16,74.64 70.23,74.64 79.88,64.99 79.88,63.46 93.59,49.75 110.87,49.75 127.12,33.49 127.12,31.97 140.84,18.25 144.39,18.25 147.44,15.2 159.63,15.2 167.76,23.33 162.68,28.41 162.68,31.46 149.98,44.16 149.98,45.68 148.97,46.7 147.44,46.7 146.93,47.21 146.93,48.22 145.92,49.24 141.85,49.24 131.19,59.91 131.19,61.94 126.61,66.51 126.61,68.03 111.37,83.27 111.37,83.78 101.21,93.94 100.2,93.94 86.48,107.66 86.48,112.74 82.93,116.29 80.89,116.29 67.69,129.5 67.69,131.03 62.1,136.61 61.59,136.61 59.05,139.15 59.05,139.66 57.53,141.19 57.02,141.19 50.92,147.28 50.92,147.79 50.41,148.3 49.4,148.3 48.89,147.79 48.89,146.27 47.87,145.25 46.86,146.27 46.86,147.79 33.65,161 33.14,161 29.59,164.55 29.59,168.62 28.06,170.14 24,170.14 22.98,171.16 22.98,175.22 18.41,179.79 18.41,185.38 4.19,199.61 4.19,202.65 1.65,205.19 1.65,206.21 19.43,223.99 38.22,205.19 57.02,205.19 63.62,198.59 63.62,195.54 65.65,193.51 65.65,192.49 83.43,174.71 83.43,174.21 87.5,170.14 89.02,170.14 90.55,168.62 B06.N1
!BAC_06
  Route2 0.254: C03.S1 46.86,88.86 46.86,87.34 34.67,75.15 34.16,75.15 33.65,74.64 33.65,70.07 29.08,65.49 29.08,64.48 22.98,58.38 22.98,54.32 19.43,50.76 19.43,47.21 17.9,45.68 17.9,34.51 35.68,16.73 36.7,17.74 117.47,17.74 133.73,1.49 180.97,1.49 182.49,3.01 200.27,3.01 225.17,27.9 225.17,30.95 238.37,44.16 238.37,45.17 284.09,90.89 285.11,90.89 301.87,107.66 301.87,110.71 317.62,126.45 317.62,130.01 347.59,159.98 350.64,159.98 363.34,172.68 365.88,172.68 379.09,185.89 380.11,185.89 419.22,225.01 419.22,264.63 411.6,272.25 399.41,272.25 379.6,292.06 212.47,292.06 178.94,258.53 178.94,257.52 168.27,246.85 164.21,246.85 162.68,245.33 162.68,242.79 150.49,230.59 150.49,226.02 116.96,192.49 114.93,192.49 107.31,184.87 107.31,183.35 99.18,175.22 99.18,174.21 96.64,171.67 96.64,170.14 93.09,166.59 93.09,164.05 91.56,162.52 B06.R1
!BAC_07  (via drill 0.61)
  Top 0.254: v75.81,109.69 76.32,110.2 76.32,147.28 v75.81,147.79
  Route2 0.254: v75.81,109.69 69.21,103.09 67.18,103.09 47.37,83.27 C03.U1
  Bottom 0.254: v75.81,147.79 76.32,147.28 86.99,147.28 89.02,149.31 90.55,149.31 B06.V1
!BAC_08
  Bottom 0.254: C03.F2 37.21,118.33 29.59,118.33 28.57,119.34 25.52,119.34 25.01,119.85 12.82,119.85 6.73,125.95 6.73,147.79 4.69,147.79 1.65,150.84 1.65,185.89 63.11,185.89 66.67,189.45 76.32,189.45 77.34,190.46 77.34,195.54 93.09,195.54 94.1,196.56 B06.C1
!BAC_09  (via drill 0.61)
  Route2 0.254: v17.9,131.03 17.9,131.53 35.17,148.81 35.17,149.31 49.91,164.05 51.94,164.05 59.05,171.16 59.56,171.16 60.07,171.67 60.07,172.17 66.67,178.78 66.67,179.29 67.18,179.79 69.72,179.79 77.34,187.41 v77.34,188.43
  Route15 0.254: v17.9,131.03 37.21,111.72 C03.J2
  Bottom 0.254: v77.34,188.43 81.91,188.43 83.94,190.46 87.5,190.46 B06.E2
!BAC_10  (via drill 0.61)
  Top 0.254: v88.01,182.33 88.01,183.86 B06.H2 | v143.89,259.55 143.89,241.26 v143.38,240.75
  Route2 0.254: v24.51,118.83 35.17,129.5 35.17,131.53 49.91,146.27 51.94,146.27 66.67,161 66.67,162.52 73.78,169.63 73.78,170.14 77.34,173.7 77.34,174.21 78.86,175.73 81.4,175.73 v88.01,182.33 | v143.89,259.55 148.46,264.12 A10.D2 | v143.38,240.75 143.38,240.25 129.66,226.53 127.63,226.53 107.31,206.21 107.31,204.69 101.72,199.1 100.2,199.1 88.01,186.91 88.01,184.87 B06.H2
  Route15 0.254: v24.51,118.83 37.71,105.63 C03.L2
!BAC_11  (via drill 0.61)
  Top 0.254: v101.72,142.2 101.21,141.69 101.21,133.06 102.23,132.04 102.23,107.15 103.75,105.63 103.75,104.61 102.23,103.09 102.23,78.19 101.72,77.69 v101.72,72.61
  Route2 0.254: v144.39,72.1 144.39,72.61 151.51,79.72 152.01,79.72 164.21,91.91 C11.R2 | v78.86,167.09 88.51,176.75 88.51,177.76 B06.K2
  Route15 0.254: v101.72,72.61 v98.17,76.16 | v58.54,76.16 46.35,88.35 45.84,88.35 38.22,95.97 38.22,97.5 37.21,98.51 C03.N2 | v78.86,167.09 78.86,166.59 82.42,163.03 82.42,161 101.21,142.2 v101.72,142.2
  Bottom 0.254: v144.39,72.1 143.89,71.59 138.3,71.59 137.79,72.1 111.37,72.1 110.87,72.61 v101.72,72.61 | v98.17,76.16 69.72,76.16 69.21,76.67 59.05,76.67 v58.54,76.16
!BLK_IN_SYNC  (via drill 0.61)
  Top 0.254: v148.46,45.68 148.46,42.13 D10.J2 | v193.16,239.23 192.65,238.72 192.65,219.42 v193.16,218.91 | v226.69,183.86 226.18,183.35 226.18,153.38 225.67,152.87 225.67,135.09 226.69,134.07 226.69,132.04 226.18,131.53 226.18,116.8 v226.69,116.29
  Route2 0.254: v148.46,45.68 151,48.22 151.51,48.22 161.67,58.38 161.67,60.41 177.41,76.16 178.94,76.16 v194.18,91.4 | v226.69,116.29 224.66,116.29 224.15,115.79 223.64,115.79 223.13,115.28 223.13,112.74 219.58,109.18 219.07,109.18 212.47,102.58 211.96,102.58 207.39,98.01 207.39,95.47 205.35,93.43 203.32,93.43 202.31,92.42 C13.R1
  Route15 0.254: v193.16,239.23 193.16,240.25 183,250.41 182.49,250.41 181.99,250.91 181.99,251.42 174.87,258.53 173.86,258.53 171.32,261.07 170.3,261.07 158.11,273.27 A10.A1 | v193.16,218.91 193.67,218.91 206.88,205.7 206.88,202.65 225.67,183.86 v226.69,183.86
  Bottom 0.254: v194.18,91.4 197.73,91.4 198.75,92.42 201.8,92.42 C13.R1
!BMB_00
  Bottom 0.254: C02.B1 28.06,130.01 28.57,129.5 46.35,129.5 47.87,131.03 50.41,131.03 51.94,129.5 80.39,129.5 82.93,132.04 99.69,132.04 100.2,132.55 100.2,134.07 94.61,134.07 C06.A1
!BMB_01  (via drill 0.61)
  Route2 0.254: v24,132.04 24,131.53 16.38,123.91 v15.87,123.91
  Route15 0.254: v109.85,122.9 105.28,127.47 105.28,127.98 100.2,133.06 v99.18,133.06
  Bottom 0.254: v109.85,122.9 92.58,122.9 91.56,123.91 C06.D1 | v99.18,133.06 98.67,132.55 86.48,132.55 85.47,133.57 80.39,133.57 79.88,133.06 79.88,132.55 39.24,132.55 38.22,133.57 33.14,133.57 32.13,132.55 24.51,132.55 v24,132.04 | v15.87,123.91 19.43,123.91 20.44,122.9 25.52,122.9 27.05,121.37 30.6,121.37 C02.E1
!BMB_02  (via drill 0.61)
  Top 0.254: v91.05,121.88 91.05,118.33 C06.F1
  Route2 0.254: v38.22,122.39 31.11,115.28 C02.H1
  Bottom 0.254: v38.22,122.39 38.73,122.9 64.13,122.9 65.15,121.88 70.23,121.88 71.24,122.9 89.02,122.9 90.04,121.88 v91.05,121.88
!BMB_03
  Bottom 0.254: C02.K1 31.11,108.17 32.13,107.15 79.88,107.15 83.43,110.71 83.43,116.29 88.51,116.29 90.55,114.26 90.55,112.23 C06.J1
!BMB_04
  Bottom 0.254: C02.M1 31.11,102.58 38.73,102.58 40.25,104.1 90.04,104.1 90.55,104.61 C06.L1
!BMB_05
  Bottom 0.254: C02.P1 31.11,95.47 32.13,94.45 43.3,94.45 45.84,96.99 52.45,96.99 54.99,94.45 79.37,94.45 81.4,92.42 82.42,92.42 83.94,93.94 83.94,97.5 89.53,97.5 90.55,98.51 C06.N1
!BMB_06
  Bottom 0.254: C02.S1 31.11,89.88 32.63,91.4 90.04,91.4 90.55,91.91 C06.R1
!BMB_07
  Bottom 0.254: C02.U1 31.11,82.77 35.17,78.7 90.04,78.7 90.55,79.21 C06.V1
!BMB_08  (via drill 0.61)
  Top 0.254: v94.1,124.93 94.1,126.96 C06.C1
  Route2 0.254: v47.37,116.8 48.38,116.8 v75.31,143.73
  Route15 0.254: v75.31,143.73 80.89,138.14 80.89,137.63 93.59,124.93 v94.1,124.93
  Bottom 0.254: v47.37,116.8 21.97,116.8 21.46,117.31 C02.F2
!BMB_09  (via drill 0.61)
  Top 0.254: v18.92,113.75 19.43,114.26 19.43,136.11 v18.92,136.61
  Route15 0.254: v18.92,113.75 20.95,111.72 C02.J2 | v71.24,137.12 71.75,137.12 81.91,126.96 81.91,124.42 v84.96,121.37
  Bottom 0.254: v18.92,136.61 20.44,138.14 36.7,138.14 38.22,136.61 46.86,136.61 48.38,138.14 54.48,138.14 56,136.61 70.73,136.61 v71.24,137.12 | v84.96,121.37 87.5,121.37 C06.E2
!BMB_10
  Bottom 0.254: C02.L2 21.46,105.63 22.98,107.15 27.05,107.15 29.59,109.69 74.29,109.69 75.31,108.67 76.32,108.67 76.83,109.18 76.83,116.8 89.02,116.8 92.58,113.25 92.58,110.2 90.04,110.2 89.02,111.21 89.02,114.26 88.51,114.26 C06.H2
!BMB_11
  Bottom 0.254: C02.N2 21.46,99.53 22.47,100.55 88.51,100.55 92.58,104.61 92.58,108.17 88.51,108.17 C06.K2
!BMR00
  Route2 0.254: B14.R2 211.96,162.52 214.5,162.52 220.59,168.62 222.63,168.62 224.15,167.09 239.39,182.33 242.95,182.33 252.6,191.99 254.12,191.99 270.89,208.75 272.92,208.75 286.13,221.96 286.13,222.97 299.84,236.69 300.86,236.69 317.62,253.45 317.62,254.47 331.85,268.69 334.89,268.69 337.94,271.74 348.1,271.74 348.61,272.25 349.63,272.25 365.88,255.99 364.87,254.98 A23.H1
!BMR01  (via drill 0.61)
  Top 0.254: v222.63,210.27 223.13,209.77 223.13,201.64 222.63,201.13 222.63,192.49 222.12,191.99 222.12,191.48 221.61,190.97 B14.E1 | v257.17,222.47 256.66,222.97 256.66,240.25 257.17,240.75 257.17,274.79 257.68,275.3 v257.68,276.82
  Route2 0.254: v245.99,211.29 246.5,211.29 257.17,221.96 v257.17,222.47
  Bottom 0.254: v222.63,210.27 223.13,209.77 239.9,209.77 241.42,211.29 v245.99,211.29 | v257.68,276.82 257.68,275.81 360.29,275.81 360.8,276.31 361.82,276.31 362.33,275.81 362.33,273.77 363.85,273.77 A23.A1
!C00  (via drill 0.61)
  Top 0.254: B13.P1 205.86,165.06 205.86,161 206.88,159.98 206.88,155.92 205.86,154.9 205.86,152.87 B13.U1 | v225.17,113.75 v225.17,133.06 | v199.26,161.51 199.26,159.47 B13.S2 | v183,232.12 183,235.17 A12.P2 | v207.89,205.7 207.89,185.38 208.91,184.37 v208.91,179.79 v208.91,168.11
  Route2 0.254: v202.81,165.06 v199.26,161.51 | v208.91,168.11 205.86,165.06 B13.P1 | v230.25,179.79 v234.82,184.37
  Route15 0.254: v225.17,113.75 227.2,111.72 C15.J2 | v225.17,133.06 205.86,152.36 B13.U1 | v183,232.12 193.67,221.45 193.67,219.93 v207.89,205.7
  Bottom 0.254: v202.81,165.06 205.35,165.06 B13.P1 | v234.82,184.37 236.85,184.37 B15.H1 | v208.91,179.79 v230.25,179.79
!C01  (via drill 0.61)
  Top 0.254: v176.4,69.56 176.4,101.05 177.41,102.07 v177.41,114.77 | v199.26,168.11 199.26,171.16 B13.M2 | v196.21,165.06 196.21,162.52 B13.R2 | v177.41,232.12 177.92,231.61 177.92,217.89 179.45,216.37 179.45,202.65 178.43,201.64 178.43,187.41 v177.92,186.91 | v192.65,132.55 193.16,133.06 193.16,157.95 192.65,158.46 v192.65,161.51
  Route2 0.254: v160.65,54.32 175.89,69.56 v176.4,69.56 | v177.41,114.77 180.46,117.82 C12.F2 179.95,118.33 179.95,119.85 v192.65,132.55 | v196.21,165.06 v199.26,168.11
  Route15 0.254: v163.19,159.98 158.11,165.06 B10.P1 | v177.92,186.91 177.92,186.4 v192.65,171.67
  Bottom 0.254: v160.65,54.32 155.06,54.32 D10.D1 | v163.19,159.98 165.22,159.98 165.73,160.49 189.1,160.49 189.61,159.98 190.62,159.98 192.15,161.51 | 192.15,161.51 192.65,162.01 195.7,162.01 B13.R2 | v177.41,232.12 179.45,232.12 A12.R2 | v192.65,171.67 198.75,171.67 B13.M2 | v192.65,161.51 192.15,161.51
!CK00  (via drill 0.61)
  Top 0.254: v211.96,153.89 211.96,155.41 B14.T2 | v227.2,191.48 226.69,190.97 226.69,189.95 225.67,188.94 225.67,167.6 224.66,166.59 224.66,157.44 v225.17,156.93
  Route2 0.254: v227.2,191.48 237.36,201.64 237.87,201.64 271.9,235.67 271.9,236.18 272.41,236.69 273.43,236.69 274.95,238.21 A18.N2 | v225.17,156.93 225.17,156.43 221.61,152.87 B14.U1
  Bottom 0.254: v211.96,153.89 216.02,153.89 217.04,152.87 218.05,152.87 218.56,152.36 221.1,152.36 B14.U1
!CK01  (via drill 0.61)
  Top 0.254: C16.S2 246.5,88.86 246.5,83.27 C16.U2 | v223.13,125.95 v223.13,143.73 | v242.44,106.64 242.44,90.39 243.45,89.37 243.45,86.83 C16.T2
  Route15 0.254: C16.T2 243.45,85.81 246.5,82.77 C16.U2 | v223.13,143.73 218.05,148.81 B14.V1 | v223.13,125.95 225.17,123.91 225.17,123.41 241.93,106.64 v242.44,106.64
!CLR_DF
  Top 0.254: D11.N2 164.71,29.43 165.22,29.93 165.22,65.49 169.79,70.07 169.79,78.19 169.29,78.7 169.29,112.23 168.78,112.74 168.78,131.53 169.79,132.55 169.79,145.25 168.78,146.27 168.78,153.38 168.27,153.89 168.27,157.44 172.33,161.51 172.33,221.45 173.35,222.47 A11.U1
!CLR_DTF  (via drill 0.61)
  Top 0.254: v177.92,28.92 v177.92,21.3 | v206.88,57.37 207.39,57.87 207.39,79.21 205.35,81.24 205.35,82.77 C13.U1
  Route2 0.254: v177.92,21.3 v169.79,13.17 | v177.92,28.92 189.61,40.6 191.13,40.6 206.37,55.84 206.37,56.35 206.88,56.86 v206.88,57.37
  Bottom 0.254: v169.79,13.17 167.76,13.17 D11.U2
!CSTA  (via drill 0.61)
  Top 0.254: v113.41,183.35 113.91,183.86 113.91,188.94 113.41,189.45 113.41,208.24 112.9,208.75 v112.9,214.34
  Route2 0.254: v113.41,183.35 99.18,169.13 99.18,165.57 98.67,165.06 98.17,165.06 85.97,152.87 85.97,152.36 82.93,149.31 82.93,148.81 81.4,147.28 81.4,145.25 80.89,144.74 79.37,144.74 73.78,139.15 73.78,138.14 71.75,136.11 71.24,136.11 62.61,127.47 C04.C1 | v112.9,214.34 117.47,218.91 117.47,219.93 117.98,220.43 118.99,220.43 127.63,229.07 127.63,230.09 139.82,242.28 v140.33,242.28
  Bottom 0.254: v140.33,242.28 141.35,243.29 141.35,244.82 147.95,244.82 A10.L2
!DATA
  Top 0.254: C13.H1 204.85,114.26 203.83,113.25 203.83,98.51 204.34,98.01 204.34,96.99 197.73,90.39 197.73,55.33 209.42,43.65 209.42,40.09 223.64,25.87 223.64,22.31 224.66,21.3 238.88,21.3 238.88,66.51 257.17,84.8 260.73,84.8 260.73,87.34 260.22,87.85 248.03,87.85 248.03,97.5 244.98,100.55 244.98,107.66 242.44,110.2 242.44,123.41 242.95,123.91 C16.D2
  Route15 0.254: B12.N1 186.56,168.11 188.59,168.11 198.24,158.46 198.24,157.95 204.85,151.35 205.86,151.35 222.63,134.58 222.63,133.57 230.25,125.95 234.82,125.95 239.9,120.87 240.91,120.87 243.96,123.91 C16.D2
  Bottom 0.254: C11.L2 164.71,105.63 166.24,107.15 175.38,107.15 177.92,109.69 190.62,109.69 194.18,113.25 203.83,113.25 204.85,114.26 C13.H1
!DB_00  (via drill 0.61)
  Top 0.254: v4.19,70.07 3.68,70.07 2.66,71.08 2.66,181.83 3.68,182.84 v3.68,195.03 | v91.05,268.19 91.05,269.71 A06.B1 | v80.89,258.03 80.89,241.26 81.4,240.75 v81.4,216.88
  Route2 0.254: v80.89,258.03 v91.05,268.19 | v47.87,216.88 28.57,197.57 28.57,195.03 28.06,194.53 B02.D1
  Route15 0.254: v77.34,71.08 v87.5,60.92
  Bottom 0.254: v87.5,60.92 90.55,60.92 D06.B1 | v77.34,71.08 73.27,71.08 72.77,70.57 58.03,70.57 57.53,70.07 41.27,70.07 39.75,71.59 39.75,72.61 38.22,72.61 35.17,69.56 4.69,69.56 v4.19,70.07 | v3.68,195.03 4.19,195.54 22.98,195.54 24.51,194.02 27.05,194.02 B02.D1 | v81.4,216.88 80.89,216.37 56,216.37 55.49,216.88 v47.87,216.88
!DB_01  (via drill 0.61)
  Top 0.254: A06.D1 91.05,263.61 91.05,260.06 92.58,258.53 v92.58,207.23 92.58,58.38 91.05,56.86 91.05,54.83 D06.D1
  Route2 0.254: v54.48,208.24 v37.21,190.97
  Bottom 0.254: v37.21,190.97 31.11,190.97 B02.E1 | v54.48,208.24 65.15,208.24 66.67,206.72 71.24,206.72 71.75,206.21 79.88,206.21 80.39,206.72 88.51,206.72 89.02,207.23 v92.58,207.23
!DB_02  (via drill 0.61)
  Top 0.254: v94.1,53.81 94.1,51.78 D06.E1 | v3.68,71.59 3.17,71.59 3.17,176.24 v3.68,176.75 | v31.11,182.84 31.11,180.81 30.6,180.3 30.6,178.78 B02.K1
  Route2 0.254: v99.18,255.49 94.61,250.91 94.1,250.91 81.4,238.21 81.4,235.67 79.37,233.64 79.37,233.13 55.49,209.26 53.97,209.26 53.46,208.75 53.46,208.24 37.21,191.99 36.7,191.99 34.67,189.95 34.67,187.92 32.13,185.38 32.13,183.86 v31.11,182.84
  Route15 0.254: v94.1,53.81 88.01,59.91 86.99,59.91 86.48,60.41 86.48,60.92 77.34,70.07 76.83,70.07 v74.8,72.1 | v99.18,255.49 94.1,260.57 A06.E1
  Bottom 0.254: v74.8,72.1 74.29,71.59 72.77,71.59 72.26,71.08 57.53,71.08 57.02,70.57 41.78,70.57 40.25,72.1 40.25,73.11 37.71,73.11 34.67,70.07 5.71,70.07 4.19,71.59 v3.68,71.59 | v3.68,176.75 25.52,176.75 27.05,178.27 30.6,178.27 B02.K1
!DB_03  (via drill 0.61)
  Top 0.254: v94.1,47.21 94.1,45.17 D06.H1 | v71.24,69.05 71.75,69.56 71.75,80.73 70.73,81.75 70.73,86.32 71.24,86.83 71.24,87.85 70.73,88.35 70.73,112.74 v71.24,113.25 | v94.1,251.93 94.1,253.96 A06.H1 | v80.39,233.13 v80.39,238.21 | v27.55,177.25 27.55,175.73 B02.L1
  Route2 0.254: v18.92,168.62 25.52,175.22 27.05,175.22 B02.L1 | v80.39,238.21 v94.1,251.93 | v80.39,233.13 55.49,208.24 55.49,207.73 54.99,207.23 54.48,207.23 38.22,190.97 38.22,190.46 32.63,184.87 32.63,182.33 v27.55,177.25
  Route15 0.254: v94.1,47.21 79.88,61.43 78.86,61.43 v71.24,69.05 | v71.24,113.25 71.24,113.75 64.13,120.87 64.13,122.9 49.91,137.12 49.91,138.14 47.87,140.17 47.87,140.68 30.6,157.95 29.59,157.95 v18.92,168.62
!DB_04  (via drill 0.61)
  Top 0.254: v81.4,47.71 81.91,48.22 81.91,71.08 v81.4,71.59 | v96.13,233.64 v96.13,250.91 | v28.06,167.09 27.05,166.08 27.05,163.03 B02.R1
  Route2 0.254: v9.77,142.2 28.06,160.49 28.06,162.01 B02.R1 | v96.13,233.64 77.34,214.85 77.34,214.34 56,193 53.46,193 35.68,175.22 35.68,174.71 v28.06,167.09
  Route15 0.254: v81.4,47.71 v87.5,41.62 | v81.4,71.59 64.13,88.86 64.13,89.88 47.87,106.13 44.83,106.13 37.71,113.25 36.7,113.25 18.92,131.03 18.92,133.06 v9.77,142.2
  Bottom 0.254: v87.5,41.62 90.55,41.62 D06.J1 | v96.13,250.91 91.56,250.91 A06.J1
!DB_05  (via drill 0.61)
  Top 0.254: A06.L1 91.05,244.31 91.05,240.75 90.04,239.74 90.04,218.4 91.05,217.39 91.05,202.15 90.04,201.13 90.04,147.79 91.05,146.77 v91.05,141.19 91.05,133.06 90.04,132.04 90.04,78.19 91.05,77.18 91.05,62.95 90.04,61.94 90.04,39.08 91.05,38.06 91.05,36.03 D06.L1
  Route15 0.254: v48.89,140.68 30.6,158.97 B02.S1
  Bottom 0.254: v48.89,140.68 65.65,140.68 66.16,141.19 v91.05,141.19
!DB_06  (via drill 0.61)
  Top 0.254: v90.04,32.47 89.53,32.98 v89.53,68.03 | v3.17,68.03 3.17,69.56 2.15,70.57 2.15,182.84 v2.66,183.35 | v90.04,241.77 90.04,240.75 89.53,240.25 v89.53,215.86 | v24.51,186.91 24.51,184.87 B02.H2
  Route2 0.254: v54.99,215.86 32.13,193 30.6,193 v24.51,186.91
  Bottom 0.254: v90.04,32.47 94.1,32.47 D06.M1 | v89.53,68.03 58.54,68.03 58.03,68.54 41.27,68.54 39.75,67.02 38.73,67.02 37.21,68.54 3.68,68.54 v3.17,68.03 | v2.66,183.35 21.97,183.35 23.49,184.87 24,184.87 B02.H2 | v90.04,241.77 94.1,241.77 A06.M1 | v54.99,215.86 v89.53,215.86
!DB_07  (via drill 0.61)
  Top 0.254: v97.15,28.92 96.64,29.43 96.64,63.46 98.17,64.99 98.17,67.02 96.13,69.05 96.13,95.47 v96.64,95.97 | v94.1,233.13 94.1,235.17 A06.P1
  Route2 0.254: v97.15,28.92 94.61,26.38 D06.P1 | v16.38,175.73 16.38,176.24 21.46,181.32 B02.J2 21.46,180.81 22.98,182.33 24.51,182.33 32.63,190.46 32.63,192.49 54.48,214.34 v54.99,214.34 | v94.1,233.13 94.1,232.63 v76.32,214.85
  Route15 0.254: v96.64,95.97 80.39,112.23 78.86,112.23 75.31,115.79 74.8,115.79 67.69,122.9 67.69,124.42 50.41,141.69 48.89,141.69 32.63,157.95 32.63,159.47 v16.38,175.73
  Bottom 0.254: v76.32,214.85 75.81,215.35 56,215.35 v54.99,214.34
!DB_08  (via drill 0.61)
  Top 0.254: 95.63,162.01 95.63,23.33 94.1,21.81 94.1,19.77 D06.S1 | 95.63,162.01 95.63,223.99 94.1,225.51 94.1,228.56 A06.S1 | v21.46,164.05 21.46,168.11 B02.N2 | v94.1,163.54 95.63,162.01
  Bottom 0.254: v21.46,164.05 93.59,164.05 v94.1,163.54
!DB_09  (via drill 0.61)
  Top 0.254: v18.92,100.04 18.92,109.18 17.9,110.2 17.9,116.29 18.92,117.31 18.92,135.09 17.9,136.11 17.9,138.65 19.43,140.17 19.43,165.06 v18.92,165.57 17.9,166.59 v17.9,187.92 | v65.15,244.31 64.64,243.8 64.64,237.2 v65.15,236.69
  Route2 0.254: v65.15,244.31 84.45,263.61 A06.D2 | v65.15,236.69 64.13,235.67 64.13,234.66 46.86,217.39 46.86,216.88 v17.9,187.92
  Route15 0.254: v67.18,72.1 67.18,71.59 70.73,68.03 71.24,68.03 78.86,60.41 78.86,59.91 84.45,54.32 D06.D2 | v47.87,71.59 47.37,71.59 43.3,75.65 43.3,76.16 32.63,86.83 31.11,86.83 19.93,98.01 19.93,99.02 v18.92,100.04
  Bottom 0.254: v67.18,72.1 66.67,71.59 57.02,71.59 56.51,71.08 48.38,71.08 v47.87,71.59 | v18.92,165.57 24,165.57 B02.P2
!DB_10  (via drill 0.61)
  Top 0.254: v80.89,51.27 81.4,51.78 81.4,69.56 v80.89,70.07 | v77.34,92.42 v77.34,73.62 | v80.39,261.07 80.39,259.04 79.88,258.53 79.88,257.52 80.39,257.01 80.39,239.74 79.37,238.72 79.37,237.2 79.88,236.69 79.88,234.15 79.37,233.64 79.37,231.61 80.89,230.09 80.89,217.89 80.39,217.39 v80.39,214.85 | v24.51,154.9 24.51,153.38 B02.U2
  Route2 0.254: v80.39,214.85 71.24,205.7 71.24,204.69 66.67,200.11 66.67,198.08 57.02,188.43 57.02,187.41 48.38,178.78 48.38,177.76 43.3,172.68 42.79,172.68 42.29,172.17 42.29,171.67 34.67,164.05 33.65,164.05 v24.51,154.9
  Route15 0.254: v77.34,73.62 v80.89,70.07 | v77.34,92.42 63.62,106.13 62.61,106.13 60.57,108.17 60.57,109.18 59.56,110.2 58.54,110.2 48.89,119.85 48.89,121.37 44.32,125.95 44.32,126.96 34.67,136.61 34.67,139.15 25.52,148.3 25.52,151.35 24.51,152.36 B02.U2
  Bottom 0.254: v80.89,51.27 87.5,51.27 D06.E2 | v80.39,261.07 87.5,261.07 A06.E2
!DB_11  (via drill 0.61)
  Top 0.254: v88.01,46.7 88.01,45.17 D06.H2 | v4.19,73.11 3.68,73.62 3.68,132.04 v4.19,132.55 | v88.01,252.44 88.01,253.96 A06.H2 | v16.89,181.32 17.39,180.81 v17.39,153.38
  Route2 0.254: v4.19,132.55 20.95,149.31 B02.V2 | v88.01,252.44 79.37,243.8 78.86,243.8 64.13,229.07 64.13,228.56 40.76,205.19 40.25,205.19 32.63,197.57 32.63,197.07 v16.89,181.32
  Route15 0.254: v88.01,46.7 79.37,55.33 78.86,55.33 v60.57,73.62 | v17.39,153.38 20.95,149.82 B02.V2
  Bottom 0.254: v60.57,73.62 37.21,73.62 36.7,73.11 v4.19,73.11
!DF  (via drill 0.61)
  Top 0.254: v171.32,82.77 171.32,81.75 172.84,80.23 172.84,66.51 171.83,65.49 171.83,40.6 169.29,38.06 169.29,31.46 168.27,30.44 168.27,26.89 167.76,26.38 D11.P2 | v198.75,110.2 200.27,111.72 200.27,115.79 199.77,116.29 199.77,119.34 200.27,119.85 200.27,122.39 198.24,124.42 198.24,125.44 197.23,126.45 197.23,131.03 197.73,131.53 197.73,156.43 195.7,158.46 195.7,160.49 194.69,161.51 194.69,175.22 v195.7,176.24
  Route2 0.254: v171.32,82.77 178.94,90.39 180.46,90.39 192.15,102.07 192.15,103.59 v198.75,110.2
  Route15 0.254: v141.35,205.7 146.43,200.62 146.43,200.11 v163.7,182.84 | v195.7,176.24 v191.13,180.81
  Bottom 0.254: v141.35,205.7 107.82,205.7 107.31,205.19 87.5,205.19 85.97,203.67 78.86,203.67 B05.A1 | v163.7,182.84 181.48,182.84 183,181.32 186.05,181.32 B12.J1 186.56,181.32 190.62,181.32 v191.13,180.81
!DTB_00  (via drill 0.61)
  Top 0.254: v129.15,124.93 129.66,125.44 129.66,138.14 130.17,138.65 v130.17,144.23
  Route15 0.254: v136.27,117.82 135.76,117.82 129.15,124.42 v129.15,124.93 | v90.04,143.22 89.02,143.22 80.39,151.85 80.39,153.38 65.15,168.62 65.15,169.13 64.64,169.63 63.11,169.63 62.1,170.65 61.59,170.65 60.07,172.17 60.07,172.68 59.05,173.7 58.54,173.7 49.91,182.33 49.91,185.38 45.33,189.95 45.33,190.97 44.83,191.48 42.29,191.48 30.6,203.16 B02.A1
  Bottom 0.254: v136.27,117.82 138.3,117.82 C09.F1 | v130.17,144.23 129.66,144.74 109.34,144.74 108.83,145.25 92.07,145.25 v90.04,143.22
!DTB_01
  Route15 0.254: B02.B1 27.55,201.13 27.55,202.65 33.14,208.24 39.24,202.15 53.46,202.15 63.62,191.99 63.62,190.97 84.96,169.63 85.47,169.63 89.02,166.08 89.02,162.01 98.67,152.36 98.67,149.31 99.69,148.3 101.21,148.3 117.98,131.53 117.98,125.44 132.2,111.21 C09.J2
!DTB_02  (via drill 0.61)
  Top 0.254: v81.4,156.93 v81.4,143.22
  Route15 0.254: v54.48,188.43 60.57,182.33 60.57,180.81 61.08,180.3 62.1,180.3 64.13,178.27 64.13,175.22 70.23,169.13 70.23,168.11 71.24,167.09 72.26,167.09 81.4,157.95 v81.4,156.93 | v81.4,143.22 82.42,143.22 92.07,133.57 92.07,133.06 99.69,125.44 101.21,125.44 105.79,120.87 106.29,120.87 108.33,118.83 108.33,117.82 112.9,113.25 112.9,112.23 115.44,109.69 115.95,109.69 v120.52,105.12
  Bottom 0.254: v54.48,188.43 53.97,188.94 49.91,188.94 49.4,189.45 35.17,189.45 34.16,188.43 28.06,188.43 B02.F1 | v120.52,105.12 121.53,104.1 129.15,104.1 129.66,104.61 130.68,104.61 131.19,104.1 136.77,104.1 138.81,102.07 141.35,102.07 C09.M1
!DTB_03  (via drill 0.61)
  Route15 0.254: v74.8,138.65 73.27,138.65 67.18,144.74 67.18,145.25 51.94,160.49 51.94,163.03 50.92,164.05 49.4,164.05 48.89,164.55 48.89,165.06 43.81,170.14 43.3,170.14 42.29,171.16 42.29,171.67 40.76,173.19 40.25,173.19 39.24,174.21 39.24,176.24 31.11,184.37 B02.H1 | v81.91,138.65 81.4,138.14 93.59,125.95 95.12,125.95 98.17,122.9 100.2,122.9 101.21,121.88 101.21,121.37 106.8,115.79 107.31,115.79 111.88,111.21 111.88,106.13 v125.6,92.42
  Bottom 0.254: v74.8,138.65 v81.91,138.65 | v125.6,92.42 132.2,92.42 C09.R2
!DTB_04  (via drill 0.61)
  Top 0.254: v18.41,162.52 18.92,162.01 18.92,141.69 v18.41,141.19 | v4.69,127.47 4.19,126.96 4.19,75.65 v4.69,75.15
  Route2 0.254: v18.41,162.52 23.49,167.6 24.51,167.6 29.08,172.17 30.6,172.17 B02.M1 | v4.69,127.47 v18.41,141.19
  Bottom 0.254: v4.69,75.15 36.7,75.15 37.71,74.13 59.56,74.13 60.07,74.64 69.21,74.64 70.23,75.65 97.15,75.65 97.66,75.15 102.74,75.15 105.28,77.69 108.33,77.69 109.85,79.21 110.87,79.21 111.88,78.19 127.12,78.19 130.17,81.24 131.19,81.24 131.69,81.75 136.77,81.75 138.3,83.27 141.35,83.27 C09.U1
!DTB_05  (via drill 0.61)
  Top 0.254: v78.35,124.93 77.34,123.91 77.34,111.72 v77.85,111.21
  Route15 0.254: v33.65,169.13 34.67,168.11 34.67,167.6 50.92,151.35 51.94,151.35 52.45,150.84 53.97,150.84 58.54,146.27 58.54,145.76 60.07,144.23 61.59,144.23 62.1,143.73 62.1,141.69 71.24,132.55 71.75,132.55 72.77,131.53 72.77,130.01 77.85,124.93 v78.35,124.93 | v77.85,111.21 80.39,108.67 80.39,107.15 88.01,99.53 88.51,99.53 97.66,90.39 98.17,90.39 v110.36,78.19
  Bottom 0.254: v33.65,169.13 28.06,169.13 B02.N1 | v110.36,78.19 110.87,77.69 132.71,77.69 134.23,79.21 135.25,79.21 135.76,79.72 138.3,79.72 C09.V1
!DTB_06  (via drill 0.61)
  Top 0.254: v21.46,198.59 21.46,194.53 B02.D2
  Route2 0.254: v31.62,209.26 31.62,208.75 v21.46,198.59
  Route15 0.254: v120.52,206.72 126.11,201.13 127.12,201.13 138.81,189.45 138.81,187.92 B09.F1
  Bottom 0.254: v120.52,206.72 120.01,206.21 107.31,206.21 106.8,205.7 99.18,205.7 96.64,208.24 92.07,208.24 91.56,207.73 88.51,207.73 88.01,207.23 79.88,207.23 79.37,206.72 72.26,206.72 71.75,207.23 67.18,207.23 65.65,208.75 55.49,208.75 54.99,209.26 v31.62,209.26
!DTB_07  (via drill 0.61)
  Route2 0.254: v134.23,144.74 138.81,149.31 B09.V1
  Route15 0.254: v71.24,143.22 71.24,143.73 64.64,150.33 63.11,150.33 61.08,152.36 61.08,156.43 49.91,167.6 48.89,167.6 32.63,183.86 32.63,184.87 26.54,190.97 25.01,190.97 B02.E2
  Bottom 0.254: v134.23,144.74 133.73,145.25 109.85,145.25 109.34,145.76 89.53,145.76 85.97,142.2 72.26,142.2 v71.24,143.22
!DTB_08  (via drill 0.61)
  Route15 0.254: v67.69,170.14 67.69,170.65 v59.05,179.29
  Bottom 0.254: v67.69,170.14 72.77,170.14 73.78,171.16 75.81,171.16 76.83,170.14 90.04,170.14 93.09,173.19 120.52,173.19 121.03,172.68 137.79,172.68 138.81,171.67 141.35,171.67 B09.M1 | v59.05,179.29 58.54,179.79 47.87,179.79 47.37,179.29 46.35,179.29 45.84,179.79 29.59,179.79 28.57,178.78 26.54,178.78 26.03,178.27 25.01,178.27 B02.K2
!DTB_09  (via drill 0.61)
  Route15 0.254: v121.53,173.7 132.71,162.52 B09.R2
  Bottom 0.254: v121.53,173.7 86.48,173.7 85.47,172.68 73.27,172.68 72.26,173.7 56,173.7 55.49,173.19 32.63,173.19 32.13,173.7 25.52,173.7 24,175.22 21.46,175.22 B02.L2
!DTB_10
  Bottom 0.254: B09.U1 141.35,152.87 137.79,152.87 136.77,153.89 64.13,153.89 60.07,157.95 50.92,157.95 48.89,159.98 34.16,159.98 32.13,157.95 22.98,157.95 22.47,158.46 22.47,162.01 21.46,162.01 B02.R2
!DTB_11  (via drill 0.61)
  Route2 0.254: v116.45,164.05 116.45,164.55 123.57,171.67 123.57,172.17 132.2,180.81 B09.J2
  Bottom 0.254: v116.45,164.05 113.91,164.05 110.87,161 88.51,161 85.97,163.54 64.13,163.54 63.62,163.03 62.1,163.03 60.57,161.51 60.57,161 55.49,161 54.48,159.98 49.91,159.98 49.4,160.49 29.59,160.49 28.57,159.47 25.01,159.47 B02.S2
!DTF  (via drill 0.61)
  Top 0.254: v159.63,14.19 159.63,59.91 158.62,60.92 158.62,61.94 159.13,62.45 159.13,72.61 157.6,74.13 157.6,80.73 156.59,81.75 156.59,98.01 156.08,98.51 156.08,107.66 v155.57,108.17 | v185.03,148.3 185.03,195.03 185.54,195.54 189.61,195.54 189.61,196.56 B12.C1 | v52.95,170.65 52.95,174.71 B04.L2
  Route2 0.254: v151,112.74 153.03,114.77 153.54,114.77 161.67,122.9 161.67,123.91 166.75,128.99 167.25,128.99 168.27,130.01 168.27,131.03 171.32,134.07 171.32,134.58 v185.03,148.3
  Route15 0.254: v159.63,14.19 163.7,10.12 D11.V2 | v155.57,108.17 v151,112.74 150.49,113.25 147.44,113.25 130.17,130.52 130.17,132.04 v113.91,148.3 | v67.18,168.11 67.18,167.6 v82.42,152.36